# EAGLE design PCBDesign01 (EAGLE 9.5.2)
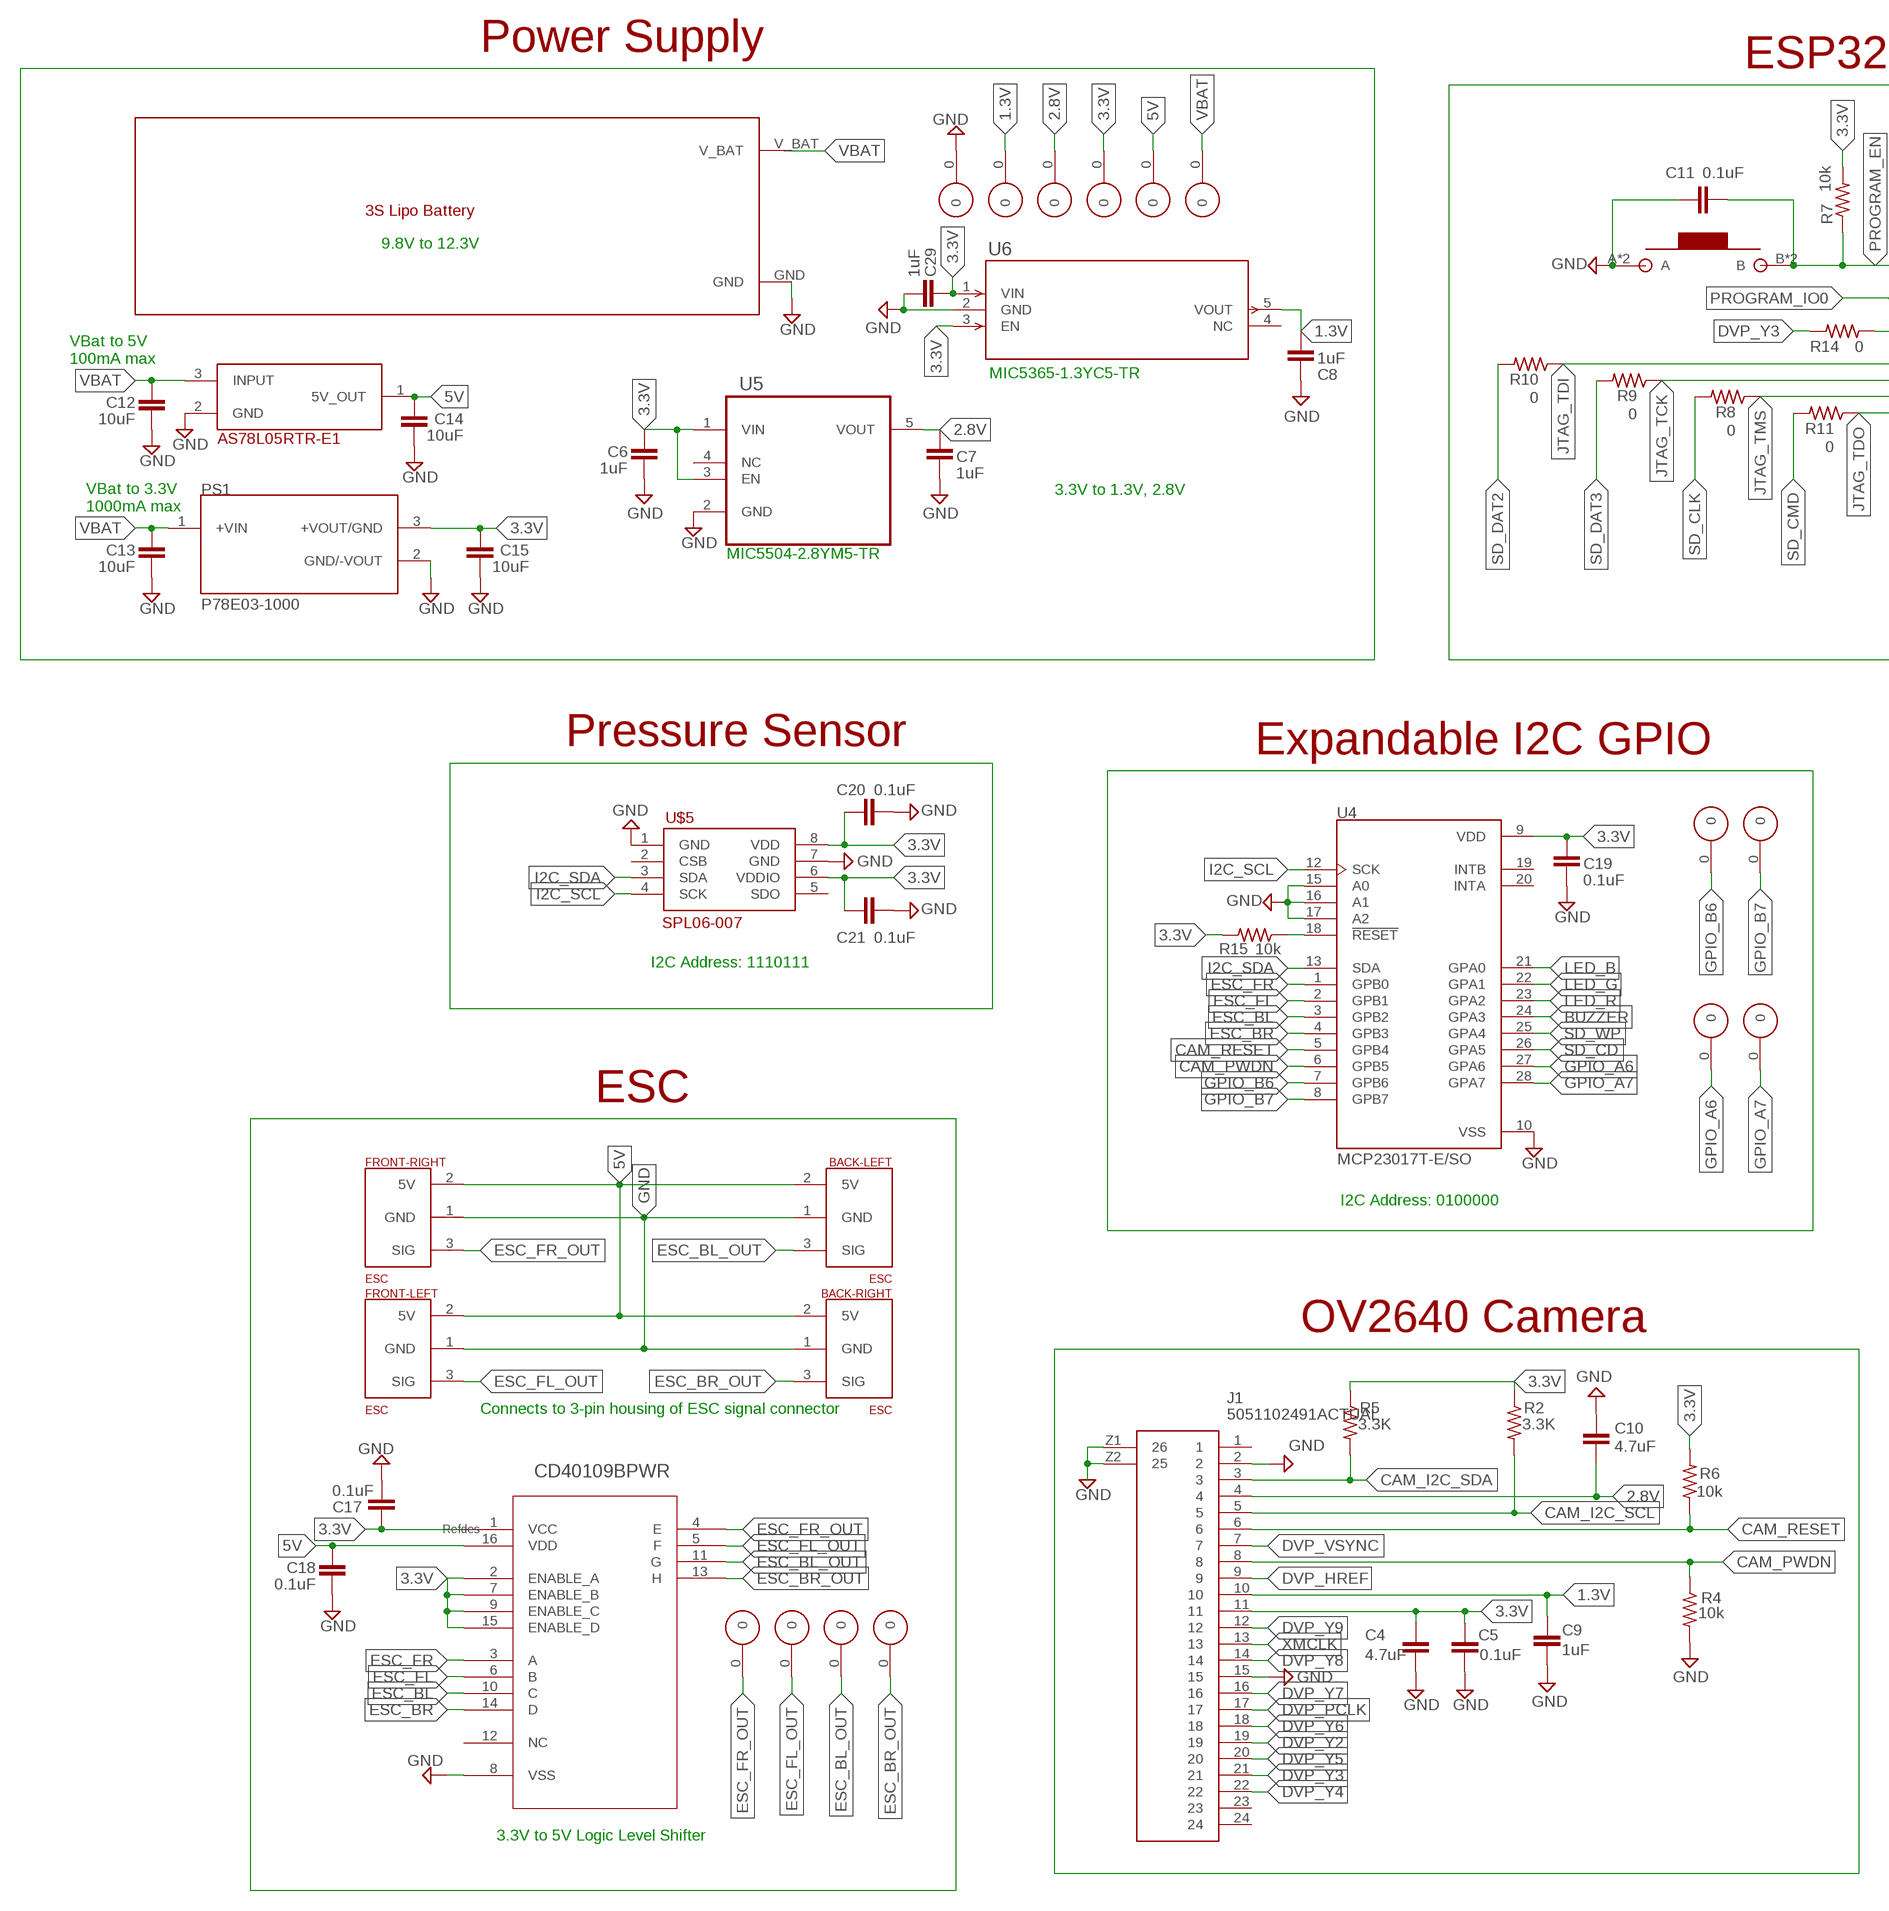
[diagram p0: schematic, sheet 1, part 1 of 2]
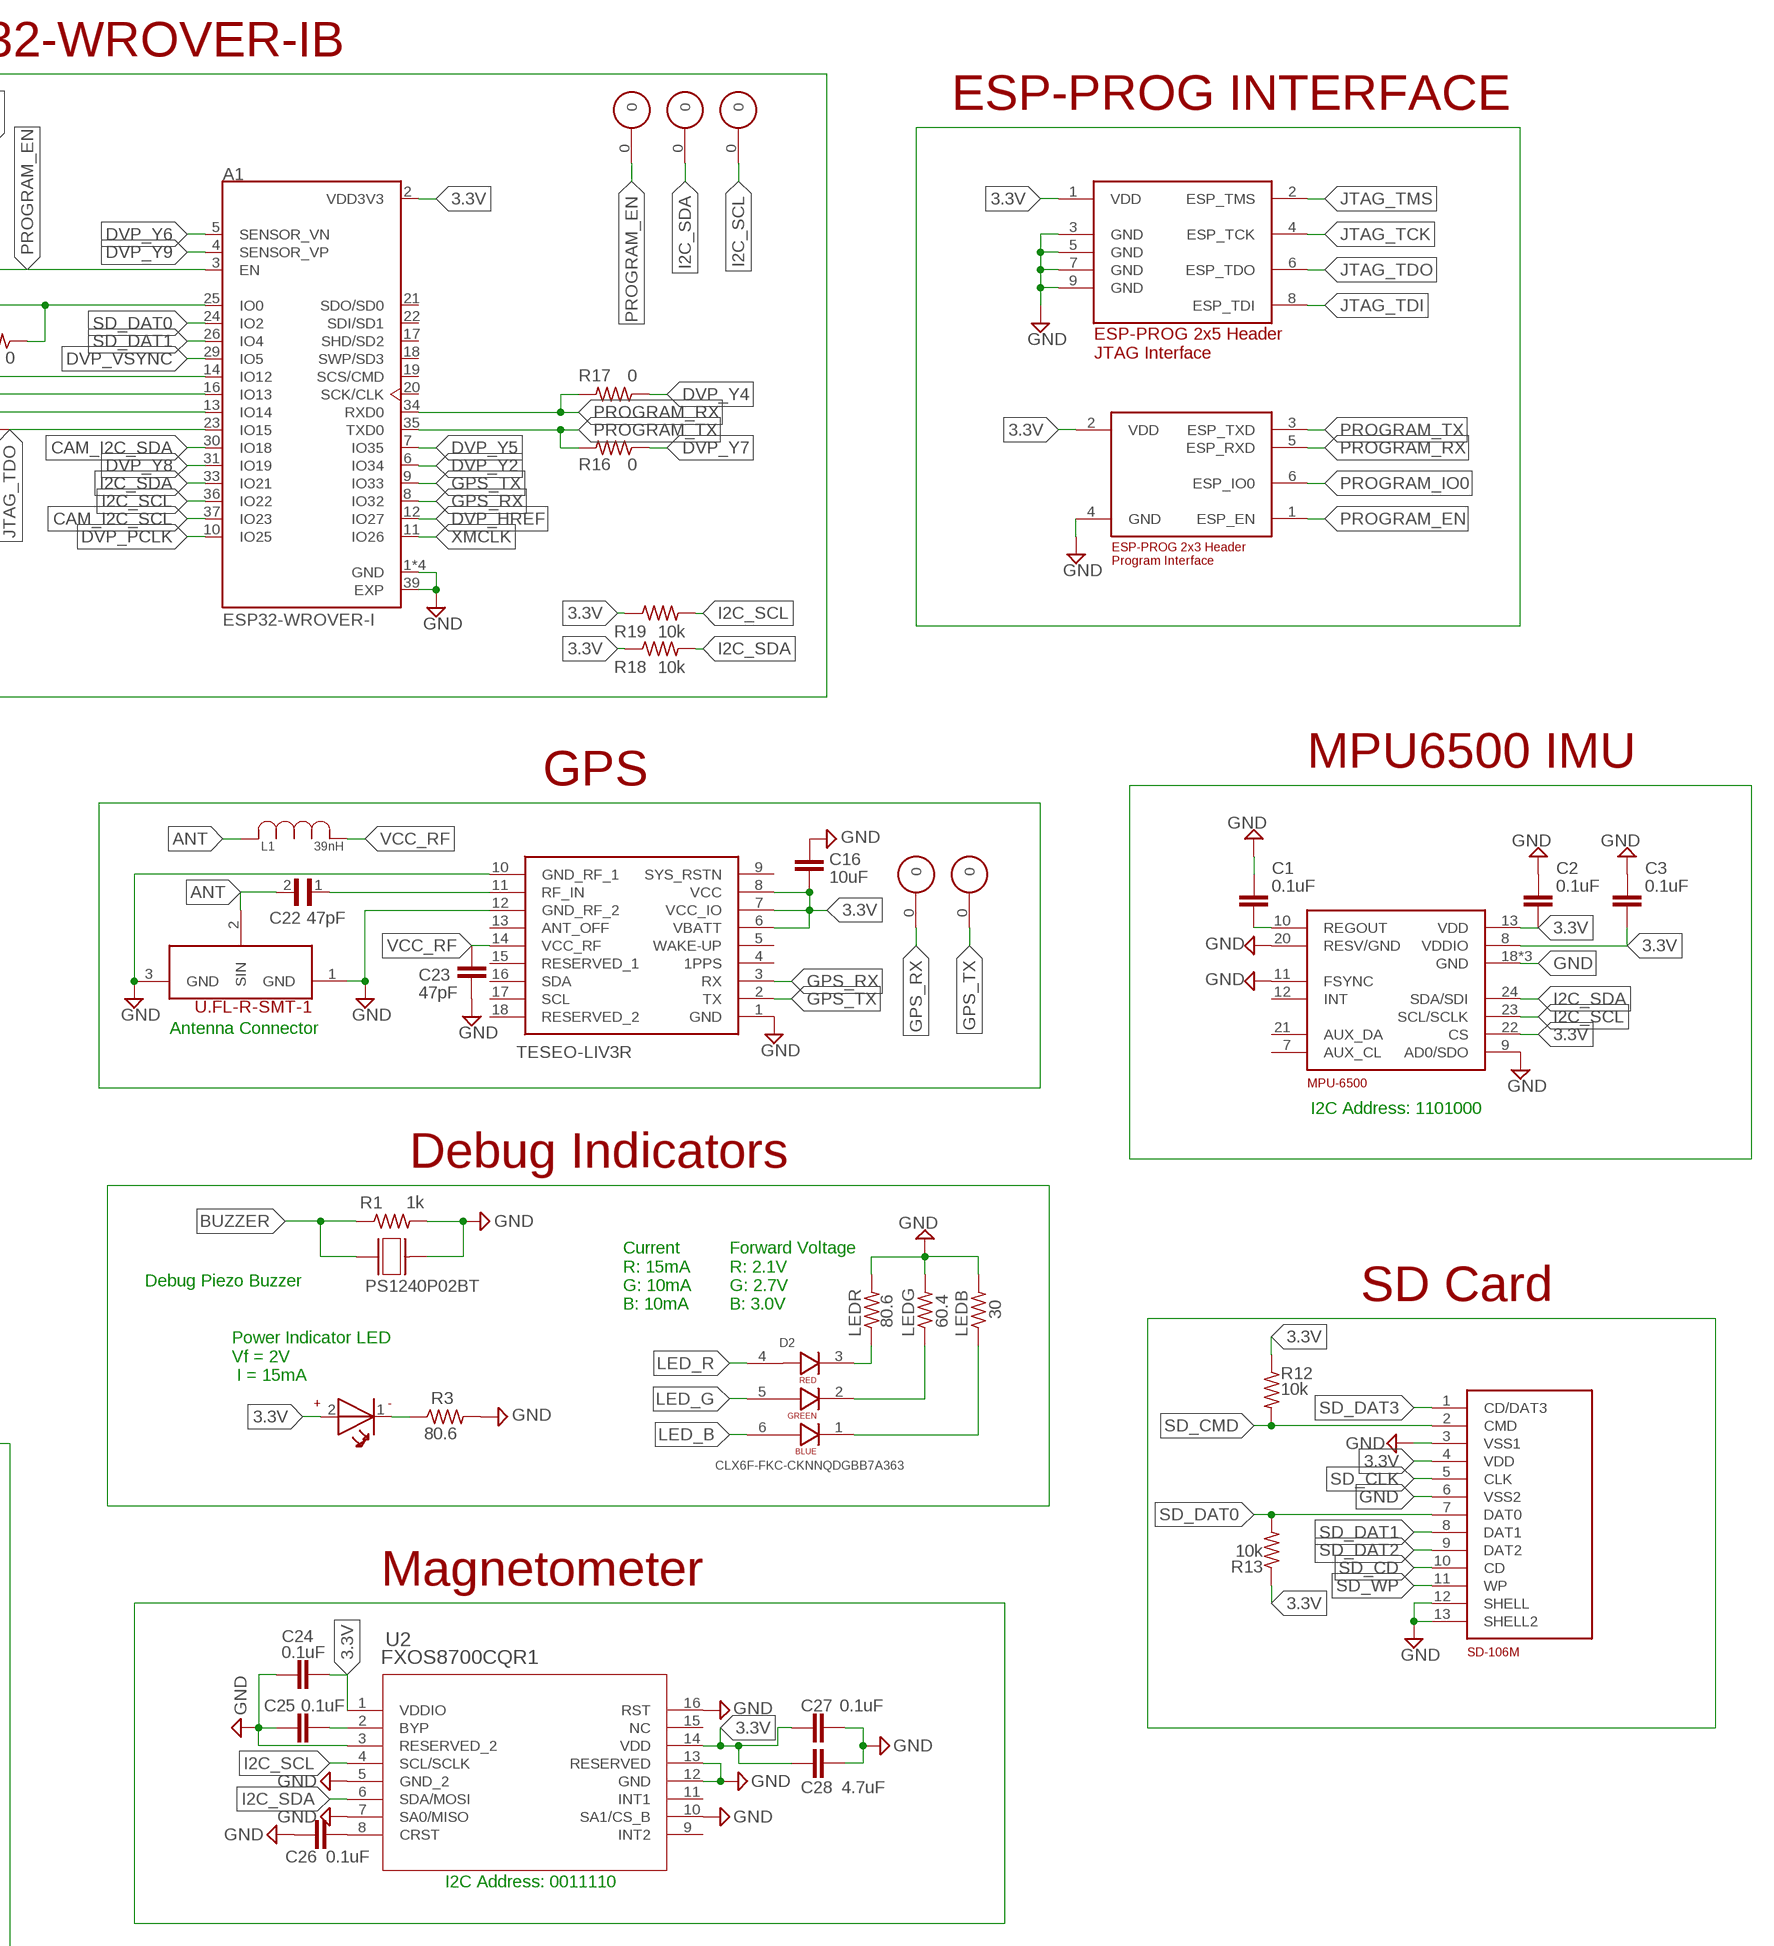
[diagram p1: schematic, sheet 1, part 2 of 2]

## Parts
A1  ESP32-WROVER-I  [XCVR_ESP32-WROVER-I]
BACK-LEFT  ESC  [MA03-1]
BACK-RIGHT  ESC  [MA03-1]
BUZZER  PS1240P02BT  [XDCR_PS1240P02BT]
C1  0.1uF  C_CHIP-0805(2012-METRIC)  [CAPC2012X110]
C2  0.1uF  C_CHIP-0805(2012-METRIC)  [CAPC2012X110]
C3  0.1uF  C_CHIP-0805(2012-METRIC)  [CAPC2012X110]
C4  4.7uF  C_CHIP-0805(2012-METRIC)  [CAPC2012X110]
C5  0.1uF  C_CHIP-0805(2012-METRIC)  [CAPC2012X110]
C6  1uF  C_CHIP-0805(2012-METRIC)  [CAPC2012X110]
C7  1uF  C_CHIP-0805(2012-METRIC)  [CAPC2012X110]
C8  1uF  C_CHIP-0805(2012-METRIC)  [CAPC2012X110]
C9  1uF  C_CHIP-0805(2012-METRIC)  [CAPC2012X110]
C10  4.7uF  C_CHIP-0805(2012-METRIC)  [CAPC2012X110]
C11  0.1uF  C_CHIP-0805(2012-METRIC)  [CAPC2012X110]
C12  10uF  C_CHIP-0805(2012-METRIC)  [CAPC2012X110]
C13  10uF  C_CHIP-0805(2012-METRIC)  [CAPC2012X110]
C14  10uF  C_CHIP-0805(2012-METRIC)  [CAPC2012X110]
C15  10uF  C_CHIP-0805(2012-METRIC)  [CAPC2012X110]
C16  10uF  C_CHIP-0805(2012-METRIC)  [CAPC2012X110]
C17  0.1uF  C_CHIP-0805(2012-METRIC)  [CAPC2012X110]
C18  0.1uF  C_CHIP-0805(2012-METRIC)  [CAPC2012X110]
C19  0.1uF  C_CHIP-0805(2012-METRIC)  [CAPC2012X110]
C20  0.1uF  C_CHIP-0805(2012-METRIC)  [CAPC2012X110]
C21  0.1uF  C_CHIP-0805(2012-METRIC)  [CAPC2012X110]
C22  47pF  C0402C470K5GACTU  [CAPC1005X55N]
C23  47pF  C_CHIP-0805(2012-METRIC)  [CAPC2012X110]
C24  0.1uF  C_CHIP-0805(2012-METRIC)  [CAPC2012X110]
C25  0.1uF  C_CHIP-0805(2012-METRIC)  [CAPC2012X110]
C26  0.1uF  C_CHIP-0805(2012-METRIC)  [CAPC2012X110]
C27  0.1uF  C_CHIP-0805(2012-METRIC)  [CAPC2012X110]
C28  4.7uF  C_CHIP-0805(2012-METRIC)  [CAPC2012X110]
C29  1uF  C_CHIP-0805(2012-METRIC)  [CAPC2012X110]
D2  CLX6F-FKC-CKNNQDGBB7A363  [SOJ100P350X290-6N]
FRONT-LEFT  ESC  [MA03-1]
FRONT-RIGHT  ESC  [MA03-1]
IC1  TESEO-LIV3R  [TESEOLIV3R]
J1  5051102491ACTUAL  [687124149022]
L1  39nH  HK100539NJ-TIND0402_22N_TAI_TAY-M  [IND0402_22N_TAI_TAY-M]
LEDB  30  R-US_CHIP-0805(2012-METRIC)  [RESC2012X65]
LEDG  60.4  R-US_CHIP-0805(2012-METRIC)  [RESC2012X65]
LEDR  80.6  R-US_CHIP-0805(2012-METRIC)  [RESC2012X65]
PS1  P78E03-1000  [CONV_P78E03-1000]
PWR-INDICATOR  WL-SMCW-150060GS75000-G  [WL-SMCW_0603]
R1  1k  R-US_CHIP-0805(2012-METRIC)  [RESC2012X65]
R2  3.3K  R-US_CHIP-0805(2012-METRIC)  [RESC2012X65]
R3  80.6  R-US_CHIP-0805(2012-METRIC)  [RESC2012X65]
R4  10k  R-US_CHIP-0805(2012-METRIC)  [RESC2012X65]
R5  3.3K  R-US_CHIP-0805(2012-METRIC)  [RESC2012X65]
R6  10k  R-US_CHIP-0805(2012-METRIC)  [RESC2012X65]
R7  10k  R-US_CHIP-0805(2012-METRIC)  [RESC2012X65]
R8  0  R-US_CHIP-0805(2012-METRIC)  [RESC2012X65]
R9  0  R-US_CHIP-0805(2012-METRIC)  [RESC2012X65]
R10  0  R-US_CHIP-0805(2012-METRIC)  [RESC2012X65]
R11  0  R-US_CHIP-0805(2012-METRIC)  [RESC2012X65]
R12  10k  R-US_CHIP-0805(2012-METRIC)  [RESC2012X65]
R13  10k  R-US_CHIP-0805(2012-METRIC)  [RESC2012X65]
R14  0  R-US_CHIP-0805(2012-METRIC)  [RESC2012X65]
R15  10k  R-US_CHIP-0805(2012-METRIC)  [RESC2012X65]
R16  0  R-US_CHIP-0805(2012-METRIC)  [RESC2012X65]
R17  0  R-US_CHIP-0805(2012-METRIC)  [RESC2012X65]
R18  10k  R-US_CHIP-0805(2012-METRIC)  [RESC2012X65]
R19  10k  R-US_CHIP-0805(2012-METRIC)  [RESC2012X65]
U2  FXOS8700CQR1  [QFN16_3X3_NXP]
U3  CD40109BPWR  [SOP65P640X120-16N]
U4  MCP23017T-E/SO  [SOIC127P1030X265-28N]
U5  MIC5504-2.8YM5-TR  [SOT95P280X145-5N]
U6  MIC5365-1.3YC5-TRSC-70_C5_MCH-M  [SC-70_C5_MCH-M]
U$1  MPU6500  [QFN40P300X300X105-24N]
U$2  TESTPOINT  [TESTPOINT]
U$3  SD-106M  [SDCARD]
U$4  U.FL-R-SMT-1  [U.FL]
U$5  SPL06-007  [SPL06-007]
U$6  ESP-PROG_JTAG_HEADER  [SAMTEC-FTS-105-01-X-D]
U$7  ESP-PROG_PROGRAM_HEADER  [SAMTEC-FTS-103-01-X-D]
U$8  RESET  BUTTON  [BUTTON]
U$9  TESTPOINT  [TESTPOINT]
U$10  TESTPOINT  [TESTPOINT]
U$11  TESTPOINT  [TESTPOINT]
U$12  TESTPOINT  [TESTPOINT]
U$13  TESTPOINT  [TESTPOINT]
U$14  TESTPOINT  [TESTPOINT]
U$15  TESTPOINT  [TESTPOINT]
U$16  TESTPOINT  [TESTPOINT]
U$17  TESTPOINT  [TESTPOINT]
U$18  TESTPOINT  [TESTPOINT]
U$19  TESTPOINT  [TESTPOINT]
U$20  TESTPOINT  [TESTPOINT]
U$21  TESTPOINT  [TESTPOINT]
U$23  TESTPOINT  [TESTPOINT]
U$24  TESTPOINT  [TESTPOINT]
U$25  TESTPOINT  [TESTPOINT]
U$26  TESTPOINT  [TESTPOINT]
U$27  TESTPOINT  [TESTPOINT]
U$28  AS78L05RTR-E1  [VREG_AP2204RA-3.3TRG1]
U$29  LARGE_BATTERY  [LARGE_BATTERY]

## Nets
1.3V: C8.1 C9.2 J1.10 U6.5(VOUT) U$17.0
2.8V: C7.1 C10.1 J1.4 U5.5(VOUT) U$18.0
3.3V: A1.2(VDD3V3) C2.2 C3.2 C4.1 C5.1 C6.1 C15.2 C16.2 C17.2 C19.2 C20.2 C21.2 C24.2 C27.1 C28.1 C29.1 IC1.6(VBATT) IC1.7(VCC_IO) IC1.8(VCC) J1.11 PS1.3(+VOUT/GND) PWR-INDICATOR.2(+) R2.1 R5.1 R6.2 R7.2 R12.1 R13.1 R15.2 R18.1 R19.1 U2.1(VDDIO) U2.14(VDD) U3.1(VCC) U3.2(ENABLE_A) U3.7(ENABLE_B) U3.9(ENABLE_C) U3.15(ENABLE_D) U4.9(VDD) U5.1(VIN) U5.3(EN) U6.1(VIN) U6.3(EN) U$1.8(VDDIO) U$1.13(VDD) U$1.22(CS) U$3.4(VDD) U$5.6(VDDIO) U$5.8(VDD) U$6.1(VDD) U$7.2(VDD) U$15.0
5V: BACK-LEFT.2(5V) BACK-RIGHT.2(5V) C14.2 C18.2 FRONT-LEFT.2(5V) FRONT-RIGHT.2(5V) U3.16(VDD) U$16.0 U$28.1(5V_OUT)
ANT: C22.2 L1.2 U$4.2(SIN)
BUZZER: BUZZER.1 R1.1 U4.24(GPA3)
CAM_I2C_SCL: A1.37(IO23) J1.5 R2.2
CAM_I2C_SDA: A1.30(IO18) J1.3 R5.2
CAM_PWDN: J1.8 R4.1 U4.6(GPB5)
CAM_RESET: J1.6 R6.1 U4.5(GPB4)
DVP_HREF: A1.12(IO27) J1.9
DVP_PCLK: A1.10(IO25) J1.17
DVP_VSYNC: A1.29(IO5) J1.7
DVP_Y2: A1.6(IO34) J1.19
DVP_Y3: J1.21 R14.2
DVP_Y4: J1.22 R17.1
DVP_Y5: A1.7(IO35) J1.20
DVP_Y6: A1.5(SENSOR_VN) J1.18
DVP_Y7: J1.16 R16.1
DVP_Y8: A1.31(IO19) J1.14
DVP_Y9: A1.4(SENSOR_VP) J1.12
ESC_BL: U3.10(C) U4.3(GPB2)
ESC_BL_OUT: BACK-LEFT.3(SIG) U3.11(G) U$25.0
ESC_BR: U3.14(D) U4.4(GPB3)
ESC_BR_OUT: BACK-RIGHT.3(SIG) U3.13(H) U$27.0
ESC_FL: U3.6(B) U4.2(GPB1)
ESC_FL_OUT: FRONT-LEFT.3(SIG) U3.5(F) U$26.0
ESC_FR: U3.3(A) U4.1(GPB0)
ESC_FR_OUT: FRONT-RIGHT.3(SIG) U3.4(E) U$24.0
GND: A1.1(GND) A1.15(GND) A1.38(GND) A1.39(EXP) A1.P$1(GND) BACK-LEFT.1(GND) BACK-RIGHT.1(GND) BUZZER.2 C1.1 C2.1 C3.1 C4.2 C5.2 C6.2 C7.2 C8.2 C9.1 C10.2 C11.1 C12.1 C13.1 C14.1 C15.1 C16.1 C17.1 C18.1 C19.1 C20.1 C21.1 C23.1 C24.1 C25.2 C26.2 C27.2 C28.2 C29.2 FRONT-LEFT.1(GND) FRONT-RIGHT.1(GND) IC1.1(GND) IC1.10(GND_RF_1) IC1.12(GND_RF_2) J1.2 J1.15 J1.Z1 J1.Z2 LEDB.2 LEDG.2 LEDR.2 PS1.2(GND/-VOUT) R1.2 R3.2 R4.2 U2.3(RESERVED_2) U2.5(GND_2) U2.7(SA0/MISO) U2.10(SA1/CS_B) U2.12(GND) U2.13(RESERVED) U2.16(RST) U3.8(VSS) U4.10(VSS) U4.15(A0) U4.16(A1) U4.17(A2) U5.2(GND) U6.2(GND) U$1.9(AD0/SDO) U$1.11(FSYNC) U$1.18(GND) U$1.20(RESV/GND) U$1.25(GND) U$1.P$1(GND) U$3.3(VSS1) U$3.6(VSS2) U$3.12(SHELL) U$3.13(SHELL2) U$4.1(GND) U$4.3(GND) U$5.1(GND) U$5.7(GND) U$6.3(GND) U$6.5(GND) U$6.7(GND) U$6.9(GND) U$7.4(GND) U$8.A U$8.A@1(A) U$21.0 U$28.2(GND) U$29.GND
GPIO_A6: U4.27(GPA6) U$2.0
GPIO_A7: U4.28(GPA7) U$19.0
GPIO_B6: U4.7(GPB6) U$14.0
GPIO_B7: U4.8(GPB7) U$20.0
GPS_RX: A1.8(IO32) IC1.3(RX) U$11.0
GPS_TX: A1.9(IO33) IC1.2(TX) U$12.0
I2C_SCL: A1.36(IO22) R19.2 U2.4(SCL/SCLK) U4.12(SCK) U$1.23(SCL/SCLK) U$5.4(SCK) U$10.0
I2C_SDA: A1.33(IO21) R18.2 U2.6(SDA/MOSI) U4.13(SDA) U$1.24(SDA/SDI) U$5.3(SDA) U$9.0
JTAG_TCK: A1.16(IO13) R9.1 U$6.4(ESP_TCK)
JTAG_TDI: A1.14(IO12) R10.1 U$6.8(ESP_TDI)
JTAG_TDO: A1.23(IO15) R11.1 U$6.6(ESP_TDO)
JTAG_TMS: A1.13(IO14) R8.1 U$6.2(ESP_TMS)
LED_B: D2.6 U4.21(GPA0)
LED_G: D2.5 U4.22(GPA1)
LED_R: D2.4 U4.23(GPA2)
N$1: D2.3 LEDR.1
N$2: D2.2 LEDG.1
N$3: C1.2 U$1.10(REGOUT)
N$4: D2.1 LEDB.1
N$5: C26.1 U2.8(CRST)
N$6: PWR-INDICATOR.1(-) R3.1
N$18: C25.1 U2.2(BYP)
N$21: C22.1 IC1.11(RF_IN)
N$23: R15.1 U4.18(!RESET)
PROGRAM_EN: A1.3(EN) C11.2 R7.1 U$7.1(ESP_EN) U$8.B U$8.B@1(B) U$23.0
PROGRAM_IO0: A1.25(IO0) R14.1 U$7.6(ESP_IO0)
PROGRAM_RX: A1.34(RXD0) R17.2 U$7.5(ESP_RXD)
PROGRAM_TX: A1.35(TXD0) R16.2 U$7.3(ESP_TXD)
SD_CD: U4.26(GPA5) U$3.10(CD)
SD_CLK: R8.2 U$3.5(CLK)
SD_CMD: R11.2 R12.2 U$3.2(CMD)
SD_DAT0: A1.24(IO2) R13.2 U$3.7(DAT0)
SD_DAT1: A1.26(IO4) U$3.8(DAT1)
SD_DAT2: R10.2 U$3.9(DAT2)
SD_DAT3: R9.2 U$3.1(CD/DAT3)
SD_WP: U4.25(GPA4) U$3.11(WP)
VBAT: C12.2 C13.2 PS1.1(+VIN) U$13.0 U$28.3(INPUT) U$29.V_BAT
VCC_RF: C23.2 IC1.14(VCC_RF) L1.1
XMCLK: A1.11(IO26) J1.13
Unconnected: A1.17(SHD/SD2) A1.18(SWP/SD3) A1.19(SCS/CMD) A1.20(SCK/CLK) A1.21(SDO/SD0) A1.22(SDI/SD1) IC1.4(1PPS) IC1.5(WAKE-UP) IC1.9(SYS_RSTN) IC1.13(ANT_OFF) IC1.15(RESERVED_1) IC1.16(SDA) IC1.17(SCL) IC1.18(RESERVED_2) J1.1 J1.23 J1.24 U2.9(INT2) U2.11(INT1) U2.15(NC) U3.12(NC) U4.19(INTB) U4.20(INTA) U5.4(NC) U6.4(NC) U$1.7(AUX_CL) U$1.12(INT) U$1.21(AUX_DA) U$5.2(CSB) U$5.5(SDO)

## Notes on the sheet
- Power Supply
- ESP32-WROVER-IB
- ESP-PROG INTERFACE
- 9.8V to 12.3V
- VBat to 5V
  100mA max
- MIC5365-1.3YC5-TR
- 3.3V to 1.3V, 2.8V
- VBat to 3.3V
  1000mA max
- MIC5504-2.8YM5-TR
- MPU6500 IMU
- Pressure Sensor | GPS
- Expandable I2C GPIO
- I2C Address: 1110111 | Antenna Connector
- I2C Address: 1101000
- ESC | Debug Indicators
- I2C Address: 0100000 | Debug Piezo Buzzer
- SD Card
- Current
  R: 15mA
  G: 10mA
  B: 10mA
- Forward Voltage
  R: 2.1V
  G: 2.7V
  B: 3.0V
- Power Indicator LED
  Vf = 2V
   I = 15mA
- OV2640 Camera
- Connects to 3-pin housing of ESC signal connector
- Magnetometer
- I2C Address: 0011110
- 3.3V to 5V Logic Level Shifter

## Library data of the parts
A1 = ESP32-WROVER-I:ESP32-WROVER-I: Module: combo; GPIO, I2C x2, I2S x2, SDIO, SPI x3, UART x3; U.FL; AVAILABILITY: Unavailable; DESCRIPTION: Bluetooth, WiFi 802.11b/g/n, Bluetooth v4.2 +EDR, Class 1, 2 and 3 Transceiver Module 2.4GHz ~ 2.5GHz Antenna Not Included, I-PEX Surface Mount; MF: Espressif Systems; MP: ESP32-WROVER-I; PACKAGE: Module Espressif Systems; PRICE: None
BACK-LEFT BACK-RIGHT FRONT-LEFT FRONT-RIGHT = ESC:ESC
BUZZER = PS1240P02BT:PS1240P02BT: Buzzers Transducer, Externally Driven Piezo 3V 4kHz 60dB @ 3V, 10cm Through Hole PC Pins; DESCRIPTION: Buzzers Transducer, Externally Driven Piezo 3V 4kHz 60dB @ 3V, 10cm Through Hole PC Pins; DIGI-KEY_PART_NUMBER: 445-2525-1-ND; DIGI-KEY_PURCHASE_URL: https://www.digikey.com/product-detail/en/tdk-corporation/PS1240P02BT/445-2525-1-ND/935930?utm_source=snapeda&utm_medium=aggregator&utm_campaign=symbol; MF: TDK; MP: PS1240P02BT; PACKAGE: 2020 TDK
C1-C21 C23-C29 = Capacitor:C: Capacitor - Generic; CATEGORY: Capacitor
C22 = C0402C470K5GACTU:C0402C470K5GACTU: CAP MLCC, 47PF, 50V, C0G, 10%, 0402; Product Range:KEMET - C Series; Capacitance; DESCRIPTION: 47pF ±10% 50V Ceramic Capacitor C0G, NP0 0402 _1005 Metric_; DIGI-KEY_PART_NUMBER: 399-7796-1-ND; DIGI-KEY_PURCHASE_URL: https://www.digikey.com/product-detail/en/kemet/C0402C470K5GACTU/399-7796-1-ND/3471519?utm_source=snapeda&utm_medium=aggregator&utm_campaign=symbol; MF: KEMET; MP: C0402C470K5GACTU; PACKAGE: 0402 KEMET
D2 = CLX6F-FKC-CKNNQDGBB7A363:CLX6F-FKC-CKNNQDGBB7A363: LED Tri-Color Blue/Green/Red 470nm/527nm/630nm Automotive 6-Pin PLCC T/R; AVAILABILITY: Unavailable; DESCRIPTION: Red, Green, Blue _RGB_ 622nm Red, 530nm Green, 470nm Blue LED Indication - Discrete 2.1V Red, 2.7V Green, 3V Blue 6-SMD, J-Lead; MF: Cree Inc.; MP: CLX6F-FKC-CKNNQDGBB7A363; PACKAGE: PLCC-6 Cree; PRICE: None
IC1 = TESEO-LIV3R:TESEO-LIV3R: RF Receiver Teseo ROM GNSS module Source: Datasheet <https://www.mouser.com/datasheet/2/389/teseo-liv3r-1594843.pdf>; DESCRIPTION: RF Receiver Teseo ROM GNSS module; HEIGHT: 2.3mm; MANUFACTURER_NAME: STMicroelectronics; MANUFACTURER_PART_NUMBER: TESEO-LIV3R; MOUSER_PART_NUMBER: 511-TESEO-LIV3R; MOUSER_PRICE-STOCK: https://www.mouser.co.uk/ProductDetail/STMicroelectronics/TESEO-LIV3R?qs=ZSypp649SOXG7EmhCFcBlw%3D%3D
J1 = 5051102491:5051102491: CONN FFC/FPC BOTTOM 24P .5MM R/A Source: Datasheet <https://www.molex.com/webdocs/datasheets/pdf/en-us/5051102491_FFC_FPC_CONNECTORS.pdf>
L1 = 0402 Inductor:HK100539NJ-T; BUILT_BY: EMA_UL_Team; MANUFACTURER_PART_NUMBER: HK100539NJ-T; SOURCELIBRARY: TaiyoYuden_2011-01-01_Digkey1; VENDOR: Taiyo Yuden
LEDB LEDG LEDR R1-R19 = Resistor:R-US: Resistor Fixed - ANSI; CATEGORY: Resistor; SUB-CATEGORY: Fixed
PS1 = P78E03-1000:P78E03-1000: NON-ISOLATED DC SWITCHING REGULATOR; MANUFACTURER: CUI Inc; STANDARD: Manufacturer Recommendations
PWR-INDICATOR = WL-SMCW:WL-SMCW: SMD mono-color Chip LED Characteristics Low energy consumption High reliability Low current requirement Fast switching No UV/IR radiation Smallest SMD package with exceptional brightness Top view Wide viewing angle PBC high-usage Applications Backlight for mobile and portable device keypads Indoor and outdoor message boards Flat backlight for LCDs, switches and symbols Display for industrial control systems and traffic Miniaturized color effects Pedestrian mark Optical indicators General lighting Toys <http://katalog.we-online.de/media/images/eipal/WL-SMCW_pf2.jpg> Details see: http://katalog.we-online.de/en/led/WL-SMCW?m Updated 2015-04-10 2015 (C) Wurth Elektronik; AVAILABILITY: Unavailable; DESCRIPTION: Green 570nm LED Indication - Discrete 2V 0603 _1608 Metric_; MF: Wurth Electronics; MP: 150060VS75000; PACKAGE: 0603 Wurth Electronics; PRICE: None
U2 = FXOS8700CQR1 Magnetometer:FXOS8700CQR1; BUILT_BY: EMA_Jessica; COPYRIGHT: Copyright (C) 2018 Accelerated Designs. All rights reserved; MANUFACTURER_PART_NUMBER: FXOS8700CQR1; SOURCELIBRARY: NXP_2019-12-31; VENDOR: NXP
U3 = CD40109BPWR:CD40109BPWR: CMOS Quad low to high Voltage level shifter; DESCRIPTION: Voltage Level Translator Unidirectional 4 Circuit 1 Channel 16-TSSOP; DIGI-KEY_PART_NUMBER: 296-12163-1-ND; DIGI-KEY_PURCHASE_URL: https://www.digikey.com/product-detail/en/texas-instruments/CD40109BPWR/296-12163-1-ND/412005?utm_source=snapeda&utm_medium=aggregator&utm_campaign=symbol; MF: Texas Instruments; MP: CD40109BPWR; PACKAGE: TSSOP-16 Texas Instruments
U4 = MCP23017T-E_SO:MCP23017T-E/SO: 16-bit Input/Output Expander, I2C interface, Pb-free28 SOIC .300in T/R; DESCRIPTION: I/O Expander 16 I²C 1.7MHz 28-SOIC; DIGI-KEY_PART_NUMBER: MCP23017T-E/SOCT-ND; DIGI-KEY_PURCHASE_URL: https://www.digikey.com/product-detail/en/microchip-technology/MCP23017T-E-SO/MCP23017T-E-SOCT-ND/5358289?utm_source=snapeda&utm_medium=aggregator&utm_campaign=symbol; MF: Microchip; MP: MCP23017T-E/SO; PACKAGE: SOIC-28 Microchip
U5 = MIC5504_2.8YM5:MIC5504-2.8YM5-TR: LOW INPUT VOLTAGE SYNCHRONOUS BOOST CONVERTER; AVAILABILITY: Unavailable; DESCRIPTION: 0.9Vin, 3.3Vout Boost Converter with Bypass Switch - 5nA Shutdown Current, SOT-23 5-SOT-23 -40 to 85; DIGIKEY-PURCHASE-URL: https://snapeda.com/shop?store=DigiKey&id=275825; MF: Texas Instruments; MP: TPS61097-33DBVR; PACKAGE: SOT-23-5 Texas Instruments; PRICE: None
U6 = MIC5365_1.3YC5:MIC5365-1.3YC5-TR; BUILT_BY: EMA_Jessica; COPYRIGHT: Copyright (C) 2018 Accelerated Designs. All rights reserved; MANUFACTURER_PART_NUMBER: MIC5365-1.3YC5-TR; SOURCELIBRARY: Microchip_2019-08-23_3; VENDOR: Microchip
U$1 = MPU-6500:MPU6500
U$2 U$9-U$21 U$23-U$27 = Test Point:TESTPOINT
U$3 = SD-106M:SD-106M
U$4 = UFL:U.FL-R-SMT-1
U$5 = SPL06-007:SPL06-007
U$6 = ESP-PROG:ESP-PROG_JTAG_HEADER
U$7 = ESP-PROG:ESP-PROG_PROGRAM_HEADER
U$8 = Button:BUTTON
U$28 = AS78L05RTR-E1:AS78L05RTR-E1
U$29 = CustomBattery:LARGE_BATTERY

## Board
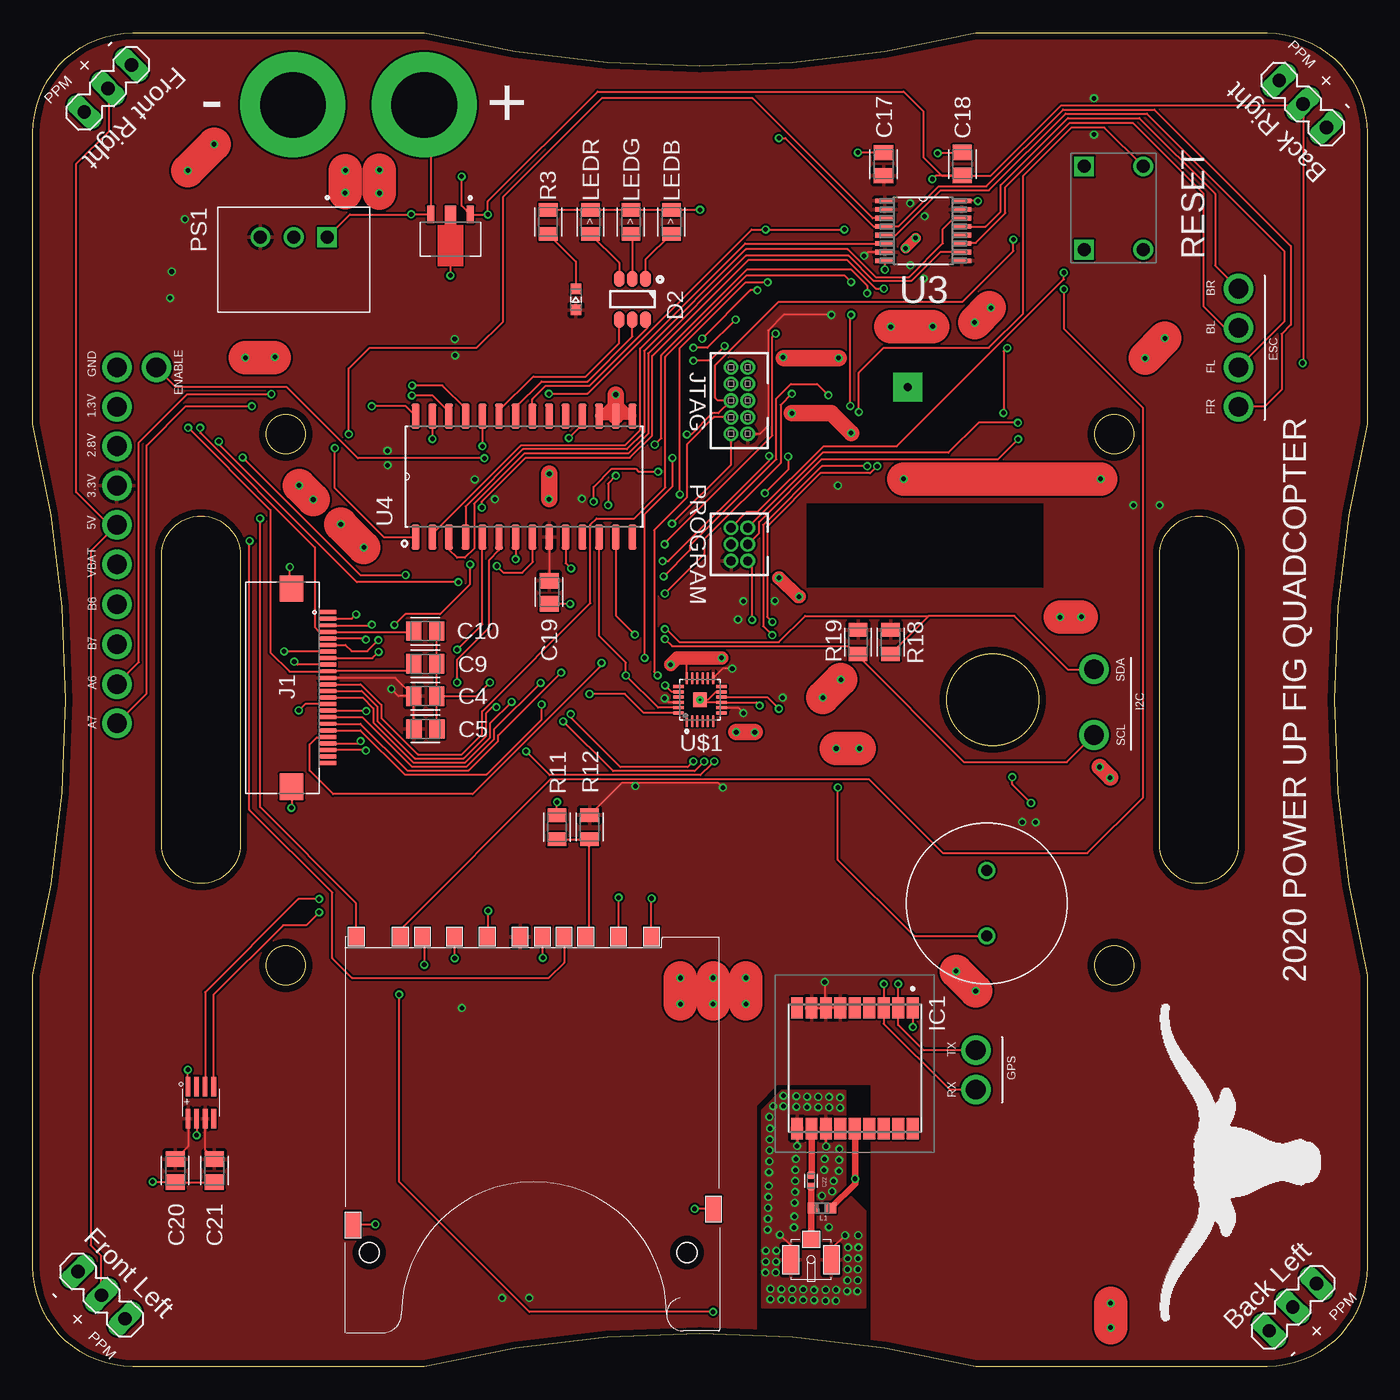
[diagram p2: board, top side]
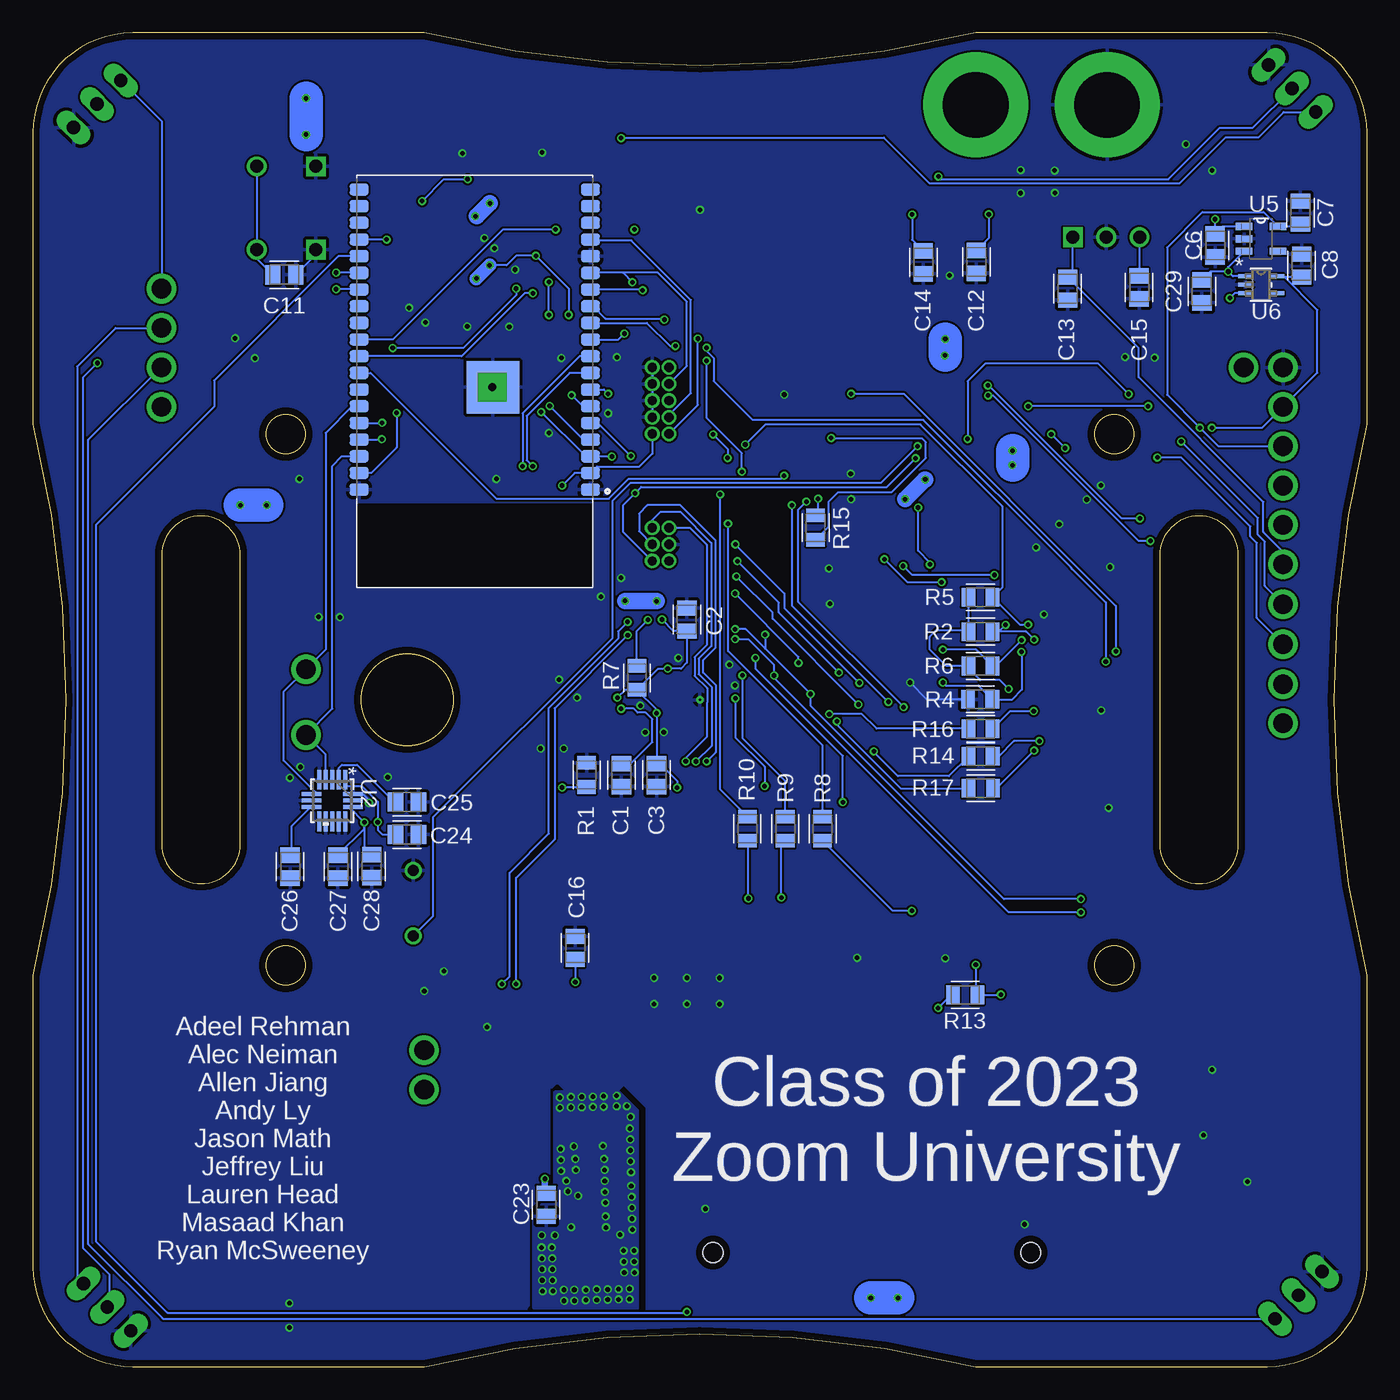
[diagram p3: board, bottom side, seen from below]

Size 101.6 x 101.6 mm. Coordinates in mm from the lower left corner, seen from the top.
Outline: 101.6,7.62 arc-90 93.98,0 71.81,0 arc27 29.79,0 7.62,0 arc-90 0,7.62 0,29.79 arc27 0,71.81 0,93.98 arc-90 7.62,101.6 29.79,101.6 arc27 71.81,101.6 93.98,101.6 arc-90 101.6,93.98 101.6,71.81 arc27 101.6,29.79 101.6,7.62
Outline: 85.8,61.8 arc-180 91.8,61.8 91.8,39.8 arc-180 85.8,39.8 85.8,61.8
Outline: 9.8,61.8 arc-180 15.8,61.8 15.8,39.8 arc-180 9.8,39.8 9.8,61.8
Outline: circle at 73.1,50.8 radius 3.51
Outline: circle at 19.26,30.57 radius 1.5
Outline: circle at 82.34,30.57 radius 1.5
Outline: circle at 82.34,71.03 radius 1.5
Outline: circle at 19.26,71.03 radius 1.5
Copper layers (1*16): Top 0.035mm / dielectric 1.5mm / Bottom 0.035mm
Design rules "default *": minimum track width 5mil, minimum drill 0.2mm, track to track 6mil, track to pad 6mil, pad to pad 6mil, via to via 6mil, smd to smd 6mil, copper to edge 20mil, drill to drill 4mil, minimum pad ring 0.2mm, minimum via ring 0.13mm, stop-mask expansion 4mil, vias tented up to drill 0mil, thermal gap 10mil

### Footprints (pad centres in the part's own frame; a part is rotated, then mirrored left to right if it is on the bottom)
XCVR_ESP32-WROVER-I = smd 1.45 x 0.93: 1 -8.81,8.26; 2 -8.81,6.99; 3 -8.81,5.72; 4 -8.81,4.45; 5 -8.81,3.18; 6 -8.81,1.91; 7 -8.81,0.64; 8 -8.81,-0.63; 9 -8.81,-1.9; 10 -8.81,-3.17; 11 -8.81,-4.44; 12 -8.81,-5.71; 13 -8.81,-6.98; 14 -8.81,-8.25; 15 -8.81,-9.52; 16 -8.81,-10.79; 17 -8.81,-12.06; 18 -8.81,-13.33; 19 -8.81,-14.6; 20 8.81,-14.6; 21 8.81,-13.33; 22 8.81,-12.06; 23 8.81,-10.79; 24 8.81,-9.52; 25 8.81,-8.25; 26 8.81,-6.98; 27 8.81,-5.71; 28 8.81,-4.44; 29 8.81,-3.17; 30 8.81,-1.9; 31 8.81,-0.63; 32 8.81,0.64; 33 8.81,1.91; 34 8.81,3.18; 35 8.81,4.45; 36 8.81,5.72; 37 8.81,6.99; 38 8.81,8.26 | smd 4 x 4: 39 -1.38,0.47 | drill 0.6 pad 2.184 square: P$1 -1.329,0.454
MA03-1 = drill 1.016 long: 1 -2.54,0; 2 0,0; 3 2.54,0
XDCR_PS1240P02BT = drill 0.85 pad 1.28: 1 -2.5,0; 2 2.5,0
CAPC2012X110 = smd 1.165 x 1.465: 1 -0.875,0; 2 0.875,0
CAPC1005X55N = smd 0.54 x 0.6: 1 -0.43,0; 2 0.43,0
SOJ100P350X290-6N = smd 1.25 x 0.8: 1 -1.55,1; 2 -1.55,0; 3 -1.55,-1; 4 1.55,-1; 5 1.55,0; 6 1.55,1
TESEOLIV3R = smd 0.9 x 1.6: 1 4.4,4.6; 2 3.3,4.6; 3 2.2,4.6; 4 1.1,4.6; 5 0,4.6; 6 -1.1,4.6; 7 -2.2,4.6; 8 -3.3,4.6; 9 -4.4,4.6; 10 -4.4,-4.6; 11 -3.3,-4.6; 12 -2.2,-4.6; 13 -1.1,-4.6; 14 0,-4.6; 15 1.1,-4.6; 16 2.2,-4.6; 17 3.3,-4.6; 18 4.4,-4.6
687124149022 = smd 0.3 x 1.3: 1 -5.75,0; 2 -5.25,0; 3 -4.75,0; 4 -4.25,0; 5 -3.75,0; 6 -3.25,0; 7 -2.75,0; 8 -2.25,0; 9 -1.75,0; 10 -1.25,0; 11 -0.75,0; 12 -0.25,0; 13 0.25,0; 14 0.75,0; 15 1.25,0; 16 1.75,0; 17 2.25,0; 18 2.75,0; 19 3.25,0; 20 3.75,0; 21 4.25,0; 22 4.75,0; 23 5.25,0; 24 5.75,0 | smd 2 x 1.8: Z1 -7.55,-2.75; Z2 7.55,-2.75
IND0402_22N_TAI_TAY-M = smd 0.813 x 0.813: 1 -0.673,0; 2 0.673,0
RESC2012X65 = smd 1.031 x 1.42: 1 -0.919,0; 2 0.919,0
CONV_P78E03-1000 = drill 1 square: 1 -2.54,0 | drill 1: 2 0,0; 3 2.54,0
WL-SMCW_0603 = smd 0.8 x 0.8: 1 -0.8,0; 2 0.8,0
QFN16_3X3_NXP = smd 1.5 x 0.305: 1 -1.587,1; 2 -1.587,0.5; 3 -1.587,0; 4 -1.587,-0.5; 5 -1.587,-1; 9 1.588,-1; 10 1.588,-0.5; 11 1.588,0; 12 1.588,0.5; 13 1.588,1 | smd 0.305 x 1.5: 6 -0.5,-1.591; 7 0,-1.591; 8 0.5,-1.591; 14 0.5,1.59; 15 0,1.59; 16 -0.5,1.59
SOP65P640X120-16N = smd 1.473 x 0.356: 1 -2.921,2.286; 2 -2.921,1.626; 3 -2.921,0.965; 4 -2.921,0.33; 5 -2.921,-0.33; 6 -2.921,-0.965; 7 -2.921,-1.626; 8 -2.921,-2.286; 9 2.921,-2.286; 10 2.921,-1.626; 11 2.921,-0.965; 12 2.921,-0.33; 13 2.921,0.33; 14 2.921,0.965; 15 2.921,1.626; 16 2.921,2.286
SOIC127P1030X265-28N = smd 1.91 x 0.6: 1 -4.61,8.255; 2 -4.61,6.985; 3 -4.61,5.715; 4 -4.61,4.445; 5 -4.61,3.175; 6 -4.61,1.905; 7 -4.61,0.635; 8 -4.61,-0.635; 9 -4.61,-1.905; 10 -4.61,-3.175; 11 -4.61,-4.445; 12 -4.61,-5.715; 13 -4.61,-6.985; 14 -4.61,-8.255; 15 4.61,-8.255; 16 4.61,-6.985; 17 4.61,-5.715; 18 4.61,-4.445; 19 4.61,-3.175; 20 4.61,-1.905; 21 4.61,-0.635; 22 4.61,0.635; 23 4.61,1.905; 24 4.61,3.175; 25 4.61,4.445; 26 4.61,5.715; 27 4.61,6.985; 28 4.61,8.255
SOT95P280X145-5N = smd 1.27 x 0.559: 1 -1.295,0.94; 2 -1.295,0; 3 -1.295,-0.94; 4 1.295,-0.94; 5 1.295,0.94
SC-70_C5_MCH-M = smd 1.079 x 0.305: 1 -1.213,0.65; 2 -1.213,0; 3 -1.213,-0.65; 4 1.213,-0.65; 5 1.213,0.65
QFN40P300X300X105-24N = smd 0.84 x 0.22: 1 -1.645,1; 2 -1.645,0.6; 3 -1.645,0.2; 4 -1.645,-0.2; 5 -1.645,-0.6; 6 -1.645,-1; 13 1.645,-1; 14 1.645,-0.6; 15 1.645,-0.2; 16 1.645,0.2; 17 1.645,0.6; 18 1.645,1 | smd 0.22 x 0.84: 7 -1,-1.645; 8 -0.6,-1.645; 9 -0.2,-1.645; 10 0.2,-1.645; 11 0.6,-1.645; 12 1,-1.645; 19 1,1.645; 20 0.6,1.645; 21 0.2,1.645; 22 -0.2,1.645; 23 -0.6,1.645; 24 -1,1.645 | smd 1.104 x 1: 25 0,0 | drill 0.2: P$1 0,0
TESTPOINT = drill 1.5: 0 0,0
SDCARD = smd 1.2 x 1.5: 1 6.251,9.959; 2 3.747,9.959; 3 0.453,9.964; 4 -1.252,9.964; 5 -3.752,9.959; 6 -6.251,9.964; 7 -8.691,9.967; 8 -10.384,9.967; 9 8.751,9.964; 10 2.1,9.964; 11 -13.726,9.957 | smd 1.2 x 2: 12 -13.981,-11.99; 13 13.476,-10.779 | hole 1.524: 11.465,-14.09; -12.735,-14.089
U.FL = smd 1.2 x 2.2: 1 -1.55,-0.488; 3 1.551,-0.496 | smd 1.3 x 1.3: 2 -0.001,-2.045
SPL06-007 = smd 0.35 x 1.5: 1 -0.975,1.219; 2 -0.326,1.219; 3 0.322,1.219; 4 0.974,1.219; 5 0.975,-1.227; 6 0.326,-1.227; 7 -0.325,-1.227; 8 -0.975,-1.227
SAMTEC-FTS-105-01-X-D = drill 0.71 pad 1.1: 1 -2.54,-0.635; 2 -2.54,0.635; 3 -1.27,-0.635; 4 -1.27,0.635; 5 0,-0.635; 6 0,0.635; 7 1.27,-0.635; 8 1.27,0.635; 9 2.54,-0.635; 10 2.54,0.635
SAMTEC-FTS-103-01-X-D = drill 0.71 pad 1.05: 1 -1.27,-0.635; 2 -1.27,0.635; 3 0,-0.635; 4 0,0.635; 5 1.27,-0.635; 6 1.27,0.635
BUTTON = drill 1 square: A -3.81,2.54; A@1 2.54,2.54 | drill 1: B -3.81,-1.96; B@1 2.54,-1.96
VREG_AP2204RA-3.3TRG1 = smd 1.3 x 0.55: 1 -1.65,1.5; 3 -1.65,-1.5 | smd 1.3 x 0.8: 2 -1.65,0
LARGE_BATTERY = drill 5 pad 8: GND 0,10; V_BAT 0,0

### Placement (x,y rotation side)
A1  67.95,75.07 180 bottom
BACK-LEFT  95.94,4.53 45 top
BACK-RIGHT  96.71,96.18 135 top
BUZZER  72.64,35.3 90 top
C1  56.78,45.06 90 bottom
C2  51.8,56.92 270 bottom
C3  54.11,45.06 90 bottom
C4  29.88,51.07 0 top
C5  29.89,48.58 0 top
C6  11.58,85.41 270 bottom
C7  5.08,87.91 90 bottom
C8  4.99,83.87 90 bottom
C9  29.88,53.54 180 top
C10  29.88,56.03 0 top
C11  82.46,83.16 180 bottom
C12  29.76,84.15 90 bottom
C13  22.8,82.12 90 bottom
C14  33.8,84.12 90 bottom
C15  17.37,82.21 90 bottom
C16  60.31,31.89 270 bottom
C17  64.78,91.6 270 top
C18  70.77,91.6 270 top
C19  39.32,58.99 90 top
C20  10.84,14.93 90 top
C21  13.82,14.93 90 top
C22  59.26,14.17 270 top
C23  62.51,12.33 90 bottom
C24  73.11,40.53 180 bottom
C25  73.11,43.01 0 bottom
C26  82.01,38.09 270 bottom
C27  78.36,38.09 270 bottom
C28  75.8,38.12 270 bottom
C29  12.58,81.91 270 bottom
D2  45.65,81.31 270 top
FRONT-LEFT  5.23,5.44 315 top
FRONT-RIGHT  5.72,97.36 225 top
IC1  62.59,22.74 0 top
J1  22.45,51.72 270 top
L1  60.09,12.09 180 top
LEDB  48.62,87.2 90 top
LEDG  45.54,87.2 90 top
LEDR  42.46,87.2 90 top
PS1  19.87,86.04 180 top
PWR-INDICATOR  41.34,81.29 270 top
R1  59.43,45.07 90 bottom
R2  29.45,55.99 0 bottom
R3  39.24,87.2 90 top
R4  29.47,50.84 180 bottom
R5  29.45,58.61 0 bottom
R6  29.45,53.38 180 bottom
R7  55.6,52.47 270 bottom
R8  41.46,40.98 270 bottom
R9  44.3,40.98 270 bottom
R10  47.19,40.98 270 bottom
R11  39.91,41.09 270 top
R12  42.4,41.1 270 top
R13  30.6,28.32 0 bottom
R14  29.43,46.49 0 bottom
R15  42,63.92 90 bottom
R16  29.43,48.59 180 bottom
R17  29.43,44.06 180 bottom
R18  65.31,55.2 270 top
R19  62.83,55.2 270 top
U2  78.8,43.12 270 bottom
U3  67.8,86.52 0 top
U4  37.4,67.8 90 top
U5  8.08,85.91 0 bottom
U6  8.08,82.41 0 bottom
U$1  50.8,50.8 90 top
U$2  6.4,51.98 0 top
U$3  38.35,22.79 0 top
U$4  59.26,7.65 180 top
U$5  12.8,20.12 0 top
U$6  53.8,73.59 90 top
U$7  53.8,62.64 90 top
U$8  82.59,88.89 90 top
U$9  80.8,53.12 0 top
U$10  80.8,48.12 0 top
U$11  71.8,21.12 0 top
U$12  71.8,24.12 0 top
U$13  6.4,61.12 0 top
U$14  6.4,58.07 0 top
U$15  6.4,67.12 0 top
U$16  6.4,64.12 0 top
U$17  6.4,73.12 0 top
U$18  6.4,70.12 0 top
U$19  6.4,49.01 0 top
U$20  6.4,55.03 0 top
U$21  6.4,76.12 0 top
U$23  9.4,76.12 0 top
U$24  91.8,73.12 180 top
U$25  91.8,79.12 180 top
U$26  91.8,76.12 180 top
U$27  91.8,82.12 180 top
U$28  31.8,86.12 270 top
U$29  29.8,96.12 90 top

### Tracks (layer width: path | path; a pad name or v marks a point on that pad's centre or on a via)
1.3V  (via drill 0.35)
  Top 0.152: C9.2 28.44,52.97 J1.10 22.41,52.93 19.55,52.93 18.08,54.41 18.08,65.26 v11.82,71.52
  Bottom 0.152: v11.82,71.52 8,71.52 U$17.0 3.8,75.72 3.8,80.49 6.37,83.06 U6.5 6.55,83.06 6.49,82.99 C8.1
2.8V  (via drill 0.35)
  Top 0.152: C10.1 28.94,55.97 J1.4 21.83,55.97 21.47,56.32 21.47,62.4 12.73,71.14 v12.73,71.53
  Bottom 0.152: U$18.0 11.32,70.12 v12.73,71.53 15.23,74.03 15.23,85.25 12.54,87.94 7.88,87.94 U5.5 5.51,86.85 C7.1
3.3V  (via drill 0.35)
  Top 0.152: U$5.8 11.82,16.8 C20.2 | C21.2 13.13,16.51 U$5.6 | C4.1 27.61,52.47 J1.11 | v53.25,53.17 52.53,53.17 U$1.13 | U$1.8 53.71,50.2 54.1,49.81 v54.1,49.78 | U4.9 39.32,63.17 C19.2 | IC1.8 IC1.7 | IC1.6 IC1.7 | v60.3,29.3 60.3,27.43 IC1.7 | C5.1 29.01,51.06 C4.1 | U3.7 63.57,84.89 v63.3,84.62 | R12.1 44.82,44.45 46.08,44.45 | v52.54,44.11 52.2,44.45 46.08,44.45 | v60.8,80.12 57.19,80.12 55.99,78.92 55.99,71.69 55.34,71.05 U$6.1 | C4.1 27.84,51.07 v27.3,51.62 | U$1.22 48.41,50.6 v48.1,50.91 | v45.88,44.22 45.88,44.25 46.08,44.45
  Bottom 0.152: PS1.3 17.37,86 C15.2 | v54.1,49.78 C3.2 | C16.2 v60.31,29.31 v60.3,29.3 | R13.1 31.67,28.32 v32.67,27.31 | R7.2 56.49,51.55 v57.08,50.96 | R15.2 41.8,65.03 v41.8,66.12 | U$6.1 54.43,69.55 55.41,68.58 58.64,68.58 A1.2 60.34,68.08 v61.3,67.12 | v53.69,56.91 52.83,56.04 C2.2 51.8,53.62 52.24,53.17 v53.25,53.17 53.97,53.17 R7.2 | R5.1 30.37,56.12 30.39,56.12 | 30.39,56.12 30.39,56.01 R2.1 | v67.9,87.62 67.8,87.62 | v67.82,82.89 v67.82,82.88 | v66.82,83.9 65.52,83.9 64.8,84.62 v63.3,84.62 60.8,82.12 v60.8,80.12 | v54.1,49.78 54.1,50.05 R7.2 | v54.1,49.78 54.1,46.19 52.54,44.63 v52.54,44.11 | 30.39,56.12 32.8,56.12 33.3,55.62 33.3,54.62 32.06,53.38 R6.2 30.37,53.2 29.46,52.29 27.98,52.29 v27.3,51.62 | 56.47,58.31 v56.5,58.34 | 32.12,77.04 v32.15,77.02 | 27,68.67 v27.02,68.66 | U2.14 77.51,42.62 v76.36,41.46 | C24.2 74.99,40.53 75.33,40.88 v75.33,41.48 75.33,43.02 76.54,44.23 77.8,44.23 U2.1 | v76.36,41.46 76.36,39.55 C28.1 | C27.1 76.36,40.97 v76.36,41.46 | U6.1 10.23,83.06 v10.58,83.41 | U5.3 10.58,83.76 v10.58,83.41 | U6.3 10.1,81.76 v10.45,81.41 | v10.58,83.41 11.95,83.41 C29.1 | U5.1 11.01,86.85 C6.1 v11.58,87.41 | v48.1,50.91 48.1,47.93 45.88,45.71 v45.88,44.22
  Bottom 1.016: v66.82,83.9 v67.82,82.89
  Bottom 1.27: 67.8,87.62 v66.8,88.62 | v54.1,58.31 56.47,58.31 | v35.19,66.08 v35.19,66.09 33.69,67.59 v33.65,67.59
  Bottom 2.54: v80.8,96.62 v80.8,93.86 | v85.8,65.62 v83.8,65.62 | v32.12,78.28 32.12,77.04 | v27,69.76 27,68.67 | v37.8,5.23 v35.74,5.23 v35.73,5.24
  pour Top: -5.85,105.54 -5.85,0.58 -1.7,-3.58 55.07,-3.58 55.07,19.92 56.67,21.52 63.83,21.52 63.83,-0.73 67.06,-3.96 108.59,-3.96 108.59,105.54
  cutout Top: 49.58,51.91 49.58,49.68 49.71,49.55 51.94,49.55 52.08,49.69 52.08,51.9 51.97,52 49.67,52
5V  (via drill 0.35)
  Top 0.152: U3.16 70.77,88.85 71.89,88.85 v71.95,88.79 | C18.2 72.94,90.73 78.28,96.06 96.59,96.06 BACK-RIGHT.2 96.72,96.17 96.72,76.48 v96.68,76.44 | C18.2 69.19,90.73 67.8,92.12 67.8,95.62 66.3,97.12 43,97.12 34.65,88.77 v34.65,87.77 U$28.1 32.64,88.42 v32.64,90.66 | FRONT-RIGHT.2 5.8,97.27 5.8,94.12 3.3,91.62 3.3,66.62 5.8,64.12 U$16.0 4.41,62.12 4.41,9.26 5.23,8.44 FRONT-LEFT.2 | C18.2 68.77,90.73 v68.5,90.45
  Bottom 0.152: v34.65,87.77 34.65,85.84 C14.2 | v96.68,76.44 97.79,75.33 97.79,9.05 95.79,7.05 95.79,4.68 BACK-LEFT.2 | v32.64,90.66 32.43,90.44 15.13,90.44 11.22,94.36 8.72,94.36 FRONT-RIGHT.2 | v71.95,88.79 70.29,90.45 v68.5,90.45
ANT
  Top 0.152: 59.26,12.25 L1.2 59.25,11.92 | U$4.2
  Top 0.508: C22.2 59.26,12.25 | 59.25,11.92 U$4.2
BUZZER  (via drill 0.35)
  Top 0.152: U4.24 v34.22,70.11 | v61.3,44.12 61.3,38.62 67.11,32.8 BUZZER.1
  Bottom 0.152: BUZZER.1 71.14,34.3 71.14,41.82 57.45,55.52 57.45,65.97 56.09,67.32 37.01,67.32 v34.22,70.11 | R1.1 59.47,44.12 v61.3,44.12
CAM_I2C_SCL  (via drill 0.35)
  Top 0.152: v25.36,55.38 | v25.36,55.38 25.26,55.47 J1.5 | v34.2,65.44 34.2,65.89 37.55,69.24 45.46,69.24 47.16,70.94 47.16,76.97 54.49,84.31 61.99,84.31 64.18,82.12 v64.8,82.12 | v74.2,77.6 73.92,77.32 73.92,72.66 v73.9,72.64 | v27.54,56.51 28.36,57.33 31.01,57.33 33.3,59.62 v33.3,61.12
  Bottom 0.152: v25.36,55.38 25.96,55.99 R2.2 28.06,55.99 v27.54,56.51 | v34.2,65.44 34.2,62.15 33.3,61.26 v33.3,61.12 | v64.8,82.12 64.8,81.62 68.82,77.6 v74.2,77.6 | v73.9,72.64 73.9,70.01 75.84,68.08 A1.37
CAM_I2C_SDA  (via drill 0.35)
  Top 0.152: v47.36,70.23 47.85,70.73 47.85,77.05 54.4,83.59 62.28,83.59 63.53,82.34 v63.53,81.76 | J1.3 25.77,56.47 v25.82,56.52
  Bottom 0.152: v47.36,70.23 45.82,71.77 34.02,71.77 27.79,65.54 27.79,59.34 R5.2 26.45,56.53 26.44,56.52 v25.82,56.52 | v63.53,81.76 64.16,81.76 68.95,76.97 A1.30
CAM_PWDN  (via drill 0.35)
  Top 0.152: J1.8 25.86,53.97 v26.33,54.44 | U4.6 35.49,62.19 34.75,61.45 34.75,56.31 32.3,53.86 v32.3,52.12
  Bottom 0.152: v26.33,54.44 26.29,54.4 26.29,51.57 27.02,50.84 R4.1 29.61,51.9 32.08,51.9 v32.3,52.12
CAM_RESET  (via drill 0.35)
  Top 0.152: v32.3,54.62 34.22,56.54 U4.5 | J1.6 23.8,54.97 24.27,54.5 25.47,54.5 v26.31,55.34
  Bottom 0.152: v26.31,55.34 28.27,53.38 R6.1 29.77,54.62 v32.3,54.62
DVP_HREF  (via drill 0.35)
  Top 0.152: v53.51,79.75 51.37,77.62 v50.3,77.62 | J1.9 20.14,53.47 v19.9,53.71
  Bottom 0.152: A1.12 58.94,80.78 58,79.83 53.59,79.83 v53.51,79.75 | v50.3,77.62 50.3,77.37 49.77,76.84 49.77,75.08 46.8,72.12 33.8,72.12 22.58,60.9 22.42,60.74 19.9,58.22 v19.9,53.71
DVP_PCLK  (via drill 0.35)
  Top 0.152: J1.17 25.09,49.47 28.84,45.72 33.06,45.72 33.06,45.73 35.13,47.8 35.13,48.55 v38.67,52.09 | v48.1,62.64 48.1,62.72 56.31,70.92 56.31,78.44 v56.55,78.69
  Bottom 0.152: v48.1,62.64 44.37,58.91 44.37,57.79 v38.68,52.09 v38.67,52.09 | A1.10 57.01,78.24 v56.55,78.69
DVP_VSYNC  (via drill 0.35)
  Top 0.152: v61.8,86.62 v55.8,86.62 54.73,86.62 42.24,74.13 39.31,74.13 v39.3,74.12 | J1.7 22.43,54.49 v19.14,54.49
  Bottom 0.152: v39.3,74.12 35.3,74.12 19.14,57.95 v19.14,54.49 | v61.8,86.62 65.8,86.62 74.18,78.24 A1.29
DVP_Y2  (via drill 0.35)
  Top 0.152: J1.19 24.94,48.47 28.3,45.12 34.55,45.12 38.74,49.31 v38.74,50.44 | v48.03,60.2 50.03,62.2 50.03,62.54 56.62,69.13 56.62,73.76 57.71,74.85 59.73,74.85 v60.58,74
  Bottom 0.152: v48.03,60.2 45.28,57.44 45.28,56.97 v38.74,50.44 | A1.6 59.74,73.16 v60.58,74
DVP_Y3  (via drill 0.35)
  Top 0.152: J1.21 24.78,47.47 v24.96,47.65
  Bottom 0.152: R14.2 28.06,46.49 26.89,47.65 v24.96,47.65
DVP_Y4  (via drill 0.35)
  Top 0.152: v25.36,46.93 25.32,46.97 J1.22
  Bottom 0.152: v25.36,46.93 28.23,44.06 R17.1
DVP_Y5  (via drill 0.35)
  Top 0.152: J1.20 22.48,47.94 21.62,47.94 21.08,47.4 21.08,45.41 22.87,43.62 33.48,43.62 43.3,53.43 v43.3,53.62 | v48.12,58.89 51.12,61.89 51.12,63.03 56.93,68.84 56.93,73.25 v57.8,74.12
  Bottom 0.152: v48.12,58.89 43.3,54.07 v43.3,53.62 | A1.7 58.11,74.43 v57.8,74.12
DVP_Y6  (via drill 0.35)
  Top 0.152: J1.18 24.94,48.97 28.49,45.42 33.19,45.42 33.19,45.43 35.43,47.67 35.43,48.08 v40.22,52.87 | v47.96,61.36 48.39,61.36 56.06,69.03 v56.06,69.37
  Bottom 0.152: v56.06,69.37 58.58,71.89 A1.5 | v47.96,61.36 44.8,58.2 44.8,57.45 v40.22,52.87
DVP_Y7  (via drill 0.35)
  Top 0.152: v25.39,49.93 22.49,49.93 J1.16
  Bottom 0.152: R16.1 27.18,49.93 v25.39,49.93
DVP_Y8  (via drill 0.35)
  Top 0.152: J1.14 25.1,50.97 25.92,50.15 25.92,49.07 28.97,46.03 32.93,46.03 34.82,47.92 34.82,49.01 v36.45,50.64 | v44.4,67.86 43.8,67.26 v43.8,65.62 | v36.45,50.64
  Bottom 0.152: A1.31 75.88,75.7 66.3,66.11 58.46,66.11 58.45,66.12 57.73,66.12 56.22,67.63 44.63,67.63 v44.4,67.86 | v43.8,65.62 43.8,57.99 v36.45,50.64
DVP_Y9  (via drill 0.35)
  Top 0.152: J1.12 24.96,51.97 26.53,50.4 26.53,49.42 29.31,46.64 32.67,46.64 34.21,48.18 34.21,49.91 42.45,58.15 42.45,64.14 42.93,64.62 45.8,64.62 48.16,66.97 48.16,76.92 54.36,83.13 61.79,83.13 v62.3,82.62 | v62.24,73.17 62.24,80.06 v62.3,80.12
  Bottom 0.152: A1.4 59.69,70.62 v62.24,73.17 | v62.3,80.12 v62.3,82.62
ESC_BL
  Top 0.152: U3.10 69.07,84.89 66.87,82.69 64.04,82.69 62.11,84.62 54.3,84.62 46.85,77.17 46.85,71.06 45.35,69.56 37.42,69.56 33.6,65.73 33.6,62.32 32.89,61.62 32.3,61.62 31.68,62.23 U4.3
ESC_BL_OUT
  Top 0.152: U3.11 70.79,85.62 71.8,85.62 74.05,87.87 74.05,89.85 78.95,94.74 83.76,94.74 89.13,89.37 89.13,80.78 90.8,79.12 U$25.0
  Bottom 0.152: U$25.0 95.3,79.12 98.23,76.18 98.23,6.83 BACK-LEFT.3
ESC_BR
  Top 0.152: U4.4 32.95,65.52 37.32,69.88 45.23,69.88 46.54,71.2 46.54,77.36 54.3,85.12 62.05,85.12 64.17,82.99 66.72,82.99 69.3,85.57 69.3,86.66 70.12,87.48 U3.14
ESC_BR_OUT
  Top 0.152: U3.13 72.55,86.85 73.7,87.99 73.7,90.01 78.8,95.11 84.26,95.11 90.03,89.35 90.03,83.88 U$27.0
  Bottom 0.152: BACK-RIGHT.3 91.8,94.87 U$27.0
ESC_FL
  Top 0.152: U4.2 30.41,63.41 37.2,70.2 45.1,70.2 46.23,71.33 46.23,77.55 54.23,85.55 U3.6
ESC_FL_OUT
  Top 0.152: U3.5 65.69,86.19 69.12,89.61 72.8,89.61 78.63,95.45 84.82,95.45 95.3,84.96 95.3,79.62 U$26.0
  Bottom 0.152: U$26.0 91.87,76.12 97.38,70.61 97.38,9.33 91.76,3.72 91.68,3.64 FRONT-LEFT.3 | FRONT-LEFT.3
ESC_FR  (via drill 0.35)
  Top 0.152: U3.3 63.93,87.48 54.8,96.62 43.3,96.62 35.8,89.12 35.8,79.62 33.8,77.62 25.64,77.62 24.05,76.02 v24.05,71.03 | v23,69.97 23,66.92 26.72,63.19 U4.1
  Bottom 0.152: v24.05,71.03 v23,69.97
ESC_FR_OUT  (via drill 0.35)
  Top 0.152: v56.8,93.58 57.3,93.58 64.04,86.85 U3.4 65.91,86.84 68.98,89.92 72.6,89.92 78.44,95.76 85.39,95.76 95.8,85.35 95.8,79.37 95.09,78.66 95.09,74.41 93.8,73.12 U$24.0
  Bottom 0.152: v56.8,93.58 56.77,93.62 36.8,93.62 33.3,90.12 14.3,90.12 10.8,93.62 8.3,93.62 6.36,95.56 FRONT-RIGHT.3
GND  (via drill 0.35)
  Top 0.152: C5.2 30.76,51.06 | 30.76,51.06 C4.2 C9.1 C10.2 | J1.2 24.28,56.97 v24.62,57.3 | J1.Z2 19.7,42.59 v19.68,42.57 | C17.1 v62.83,92.47 v62.82,92.47 | C18.1 70.71,92.42 v68.89,92.42 | IC1.1 66.99,25.89 v67.01,25.87 | IC1.12 v60.39,16.79 v60.4,16.78 | IC1.10 v58.19,16.82 v58.19,16.81 | U$3.13 50.41,12.01 v50.39,12.03 | U$4.3 57.71,9.25 v56.89,10.06 | v55.33,50.36 55.09,50.6 U$1.9 51,50.6 U$1.P$1 51.41,50.8 52,51.39 52.44,51.39 U$1.11 | U$1.20 48.63,51.4 v48.14,51.89 | U4.10 40.57,61.21 v40.98,60.81 | v40.91,58.09 39.34,58.09 C19.1 | U$3.6 32.1,31.14 v32.12,31.11 | U$3.3 38.8,31.17 v38.83,31.14 | R3.2 LEDR.2 LEDG.2 LEDB.2 v50.8,88.11 v50.8,88.12 | U$3.12 24.41,10.84 v26.08,10.84 | C21.1 C20.1 9.15,14.06 v9.11,14.09 | U$5.1 11.8,20.86 v11.8,22.62 | U$5.7 v12.47,17.63 | U$28.2 v31.8,83.12 | U3.8 v64.87,83.56 | 39.32,66.1 v39.3,66.08 | 67.21,85.94 v67.21,85.97 | U$1.18 49.8,53.99 | v34.8,52.12 33.75,51.06 30.76,51.06 | 72.83,80.66 v72.95,80.66 | 44.38,73.68 v44.38,74.04 | 23.8,89.42 v23.78,89.41 | 82.03,44.88 v82.03,44.85 | v78.22,57.1 78.24,57.12 | 18.37,76.85 v18.42,76.91 | 54.96,48.33 v54.97,48.32 | v57.13,76.88 57.18,76.83 | v62.93,47.09 | v21.35,66.05 v21.35,66.04 | U$4.1 60.81,8.96 v61.85,10 | J1.Z1 19.58,59.39 v19.58,60.91 | J1.15 20.73,50.47 v20.25,49.99 | v76,42.94 74.58,44.36 v74.58,44.91 | v60.15,50.95
  Top 0.508: U4.17 44.38,73.68 U4.15
  Top 0.61: U4.15 U4.16 U4.17
  Top 0.813: v66.45,85.18 67.21,85.94
  Top 1.016: v48.56,53.47 49.08,53.99 49.8,53.99 v52.45,53.99 | v56.8,60.08 56.84,60.08 58.27,58.65 v58.35,58.65
  Top 1.27: v39.32,68.01 39.32,66.1 | v57.8,72.62 60.8,72.62 v62.3,71.12 | U4.16 v44.38,74.04 | v81.23,45.68 82.03,44.88 | v53.56,48.33 54.96,48.33 | v61.35,76.83 57.18,76.83
  Top 2.54: v26.39,91.15 v26.39,89.39 | v49.3,27.62 v49.3,29.62 | v51.8,27.62 v51.8,29.62 | v54.3,27.62 v54.3,29.62 | v66.3,67.62 v81.3,67.62 | v13.8,93.12 v11.8,91.12 | v65.32,79.21 65.34,79.23 v68.52,79.23 | v71.71,79.54 | 72.83,80.66 v71.71,79.54 | v70.3,30.12 v71.8,28.62 | v23.8,91.12 23.8,89.42 | v86.2,78.33 84.7,76.83 v84.7,76.81 | 78.24,57.12 v79.83,57.12 | v16.18,76.85 18.37,76.85 | v61.53,52.33 v60.15,50.95 | v61.18,47.09 v62.93,47.09 | v20.27,67.13 v21.35,66.05 | v82.07,4.84 v82.07,2.98 | v23.44,64.17 v23.44,64.16 v25.2,62.4
  Bottom 0.152: C11.1 80.05,84.7 U$8.A | U$6.9 U$6.7 U$6.5 U$6.3 | R4.2 33.52,50.84 v34.8,52.12 | U2.16 76.48,43.62 76,43.13 v76,42.94 | v76,42.94
  other vias: 56.09,19.03 56.36,19.85 57.15,20.63 57.15,19.85 58.96,20.57 58.14,20.6 58.14,19.81 58.96,19.78 59.8,19.77 59.8,20.55 60.63,20.54 60.63,19.75 61.47,20.51 61.47,19.72 56.08,15.64 56.05,14.81 56.1,16.48 56.11,17.31 56.14,18.14 58.01,12.49 58.04,13.31 58.05,14.15 58.06,14.98 58.1,15.82 55.95,10.44 55.98,11.26 55.99,12.1 56.01,12.93 56.04,13.77 57.96,10.61 57.99,11.45 58.66,5.09 59.49,5.06 59.49,5.85 58.66,5.88 57.82,5.89 57.82,5.1 56.99,5.12 56.99,5.9 56.16,5.15 56.16,5.94 62.02,6.58 61.99,5.75 62.78,5.75 62.81,6.58 62.82,7.42 62.04,7.42 62.05,8.25 62.84,8.25 62.08,9.08 62.87,9.08 55.82,8.84 56.61,8.84 56.6,8.01 55.81,8.01 56.56,7.17 55.78,7.17 60.37,5.85 61.16,5.85 61.15,5.02 60.36,5.02 60.62,10.62 62.85,10 60.09,13.01 60.86,13.35 60.25,14.98 60.28,15.81 60.97,14.15 61.37,14.91 61.39,15.74 61.42,16.58
  pour Top: 55.55,4.48 55.55,19.57 57.02,21.04 61.85,21.04 61.85,13.4 63.37,11.87 63.37,4.48
  pour Bottom: -3.07,103.9 -3.07,3.31 1.77,-1.53 52.08,-1.53 54.84,1.23 54.84,19.72 56.59,21.47 57.02,21.04 55.55,19.57 55.55,4.4 63.45,4.4 63.5,4.45 63.5,11.74 61.9,13.34 61.9,20.91 61.8,21.02 61.04,21.02 61.57,21.55 61.8,21.55 62.1,21.24 62.28,21.24 62.28,13.55 63.83,12 63.83,4.66 64.08,4.4 63.73,4.05 55.02,4.05 55.02,1.58 58.07,-1.47 104.49,-1.47 104.49,103.9
  cutout Bottom: 78.08,43.91 79.58,43.91 79.58,42.41 78.08,42.41
GPIO_A6  (via drill 0.35)
  Top 0.152: U$2.0 8.08,53.66 8.08,70.41 11.75,74.08 v18.17,74.08 | U4.27 30.41,70.69 v30.43,70.67
  Bottom 0.152: v18.17,74.08 20.49,76.41 29.08,76.41 30.43,75.05 v30.43,70.67
GPIO_A7  (via drill 0.35)
  Top 0.152: U$19.0 8.66,51.27 8.66,70.18 11.64,73.16 v16.68,73.16 | U4.28 28.4,73.16 v25.81,73.16
  Bottom 0.152: v16.68,73.16 v25.8,73.16 v25.81,73.16
GPIO_B6  (via drill 0.35)
  Top 0.152: v32.41,59.75 24.68,59.75 14.15,70.28 v14.15,70.48 | U4.7 36.76,61.51 v36.75,61.5
  Bottom 0.152: U$14.0 7.8,59.47 7.8,62.85 8.32,63.37 8.32,64.65 v14.15,70.48 | v36.75,61.5 35,59.75 v32.41,59.75
GPIO_B7  (via drill 0.35)
  Top 0.152: v15.97,69.26 24.92,60.31 28.37,60.31 v28.38,60.3 | v35.33,60.98 35.83,60.49 37.27,60.49 38.08,61.3 38.08,63.15 U4.8
  Bottom 0.152: U$20.0 8.4,57.03 8.4,62.74 8.89,63.24 8.89,64 14.16,69.26 v15.97,69.26 | v28.38,60.3 34.65,60.3 v35.33,60.98
GPS_RX  (via drill 0.35)
  Top 0.152: U$11.0 69.8,21.12 64.79,26.13 IC1.3 64.79,27.81 64.8,27.8 v64.8,29.15 | v63.54,68.58 60.07,68.58 55.6,64.12 55.6,56.41 v56.3,55.71
  Bottom 0.152: A1.8 60.72,75.7 63.99,72.42 63.99,69.04 v63.54,68.58 | v56.3,55.71 61.87,50.14 61.87,40.17 64.8,37.24 v64.8,29.15
GPS_TX  (via drill 0.35)
  Top 0.152: U$12.0 67.8,24.12 65.89,26.03 IC1.2 v65.89,29.15 | v64.3,68.58 v64.29,68.58 63.76,68.05 59.97,68.05 55.91,63.99 55.91,57.12 56.29,56.73 v56.32,56.73 | v65.89,29.15
  Bottom 0.152: A1.9 59.95,76.97 64.3,72.62 v64.3,68.58 | v65.89,29.15 65.3,29.74 65.3,37.62 62.3,40.62 62.3,50.19 57.03,55.45 57.03,56.02 v56.32,56.73
I2C_SCL  (via drill 0.35)
  Top 0.152: U4.12 43.11,55.67 45.16,53.63 v45.16,52.65 47.6,50.2 U$1.23 | U$5.4 13.77,28.34 19.05,33.62 20.8,33.62 v21.8,34.62 | v48.13,55.42 48.68,54.87 62.07,54.87 62.83,54.12 | U$10.0 78.74,46.05 70.89,46.05 62.83,54.12 | R19.2 62.83,54.12
  Bottom 0.152: A1.36 78.07,69.35 78.8,68.62 78.8,50.12 U$10.0 79.3,46.62 U2.4 | v21.8,34.62 27.3,34.62 45.16,52.47 v45.16,52.65 45.16,53.44 47.13,55.42 v48.13,55.42
I2C_SDA  (via drill 0.35)
  Top 0.152: U$5.3 13.12,28.52 20.22,35.62 v21.8,35.62 | U$1.24 46.51,49.8 45.07,51.24 v42.39,51.24 | U4.13 44.38,57.22 v45.85,55.76 | v48.13,56.18 48.24,56.18 49.24,55.18 56.8,55.18 58.8,57.18 68.2,57.18 | U$9.0 78.8,53.12 74.74,57.18 68.2,57.18 | R18.2 68.2,57.18
  Bottom 0.152: v45.85,55.76 45.85,54.7 v42.39,51.24 | v21.8,35.62 27.66,35.62 42.39,50.34 v42.39,51.24 | v42.39,51.24 47.33,56.18 v48.13,56.18 | A1.33 77.26,73.16 79.3,71.12 79.3,54.62 U$9.0 82.49,51.42 82.49,46.17 80.05,43.72 80.03,43.72 U2.6
JTAG_TCK  (via drill 0.35)
  Top 0.152: U$6.4 51.86,72.32 49.8,70.25 49.8,66.22 47.3,63.72 47.3,52.92 v47.57,52.66
  Bottom 0.152: A1.16 59.06,85.78 56.03,85.78 51.49,81.24 51.49,74.15 53.16,72.48 U$6.4 | R9.1 44.3,44.62 47.57,47.89 v47.57,52.66
JTAG_TDI  (via drill 0.35)
  Top 0.152: v49.27,66.44 49.24,66.47 49.24,77.55 54.28,82.59 v55.94,82.59
  Bottom 0.152: U$6.8 51.8,76.22 51.8,81.12 54,83.32 A1.14 56.66,83.32 v55.94,82.59 | R10.1 49.27,43.98 v49.27,66.44
JTAG_TDO  (via drill 0.35)
  Top 0.152: v74.66,85.86 74.66,84.97 70.8,81.12 56.8,81.12 51.97,76.29 51.97,73.78 52.16,73.59 U$6.6 52.2,72.62 51.74,72.62 50.13,71.01 v49.8,71.01 | v48.7,69.21 48.7,67.04 46.57,64.92 v46.57,53.99 v46.58,53.99 | R11.1 39.91,43 v39.92,43.01
  Bottom 0.152: v74.66,85.86 | v74.66,85.86 A1.23 | v49.8,71.01 48.7,69.9 v48.7,69.21 | v39.92,43.01 39.92,46.53 46.58,53.19 v46.58,53.99
JTAG_TMS  (via drill 0.35)
  Top 0.152: v55.17,82 54.64,82 v50.95,78.31 | v48.67,64.21 53.16,68.71 U$6.2
  Bottom 0.152: U$6.2 50.95,73.26 v50.95,78.31 | v55.17,82 55.22,82.05 A1.13 | R8.1 41.46,47.3 48.67,54.51 v48.67,64.21
LED_B
  Top 0.152: U4.21 38.03,73.69 39.05,74.71 42.39,74.71 46.8,79.12 46.8,79.61 D2.6
LED_G
  Top 0.152: U4.22 36.76,73.08 38.74,75.05 42.24,75.05 45.65,78.47 D2.5
LED_R
  Top 0.152: U4.23 35.49,72.81 38.11,75.43 42.11,75.43 44.65,77.97 D2.4
N$1
  Top 0.152: LEDR.1 44.65,84.09 D2.3
N$2
  Top 0.152: LEDG.1 45.65,86.17 D2.2
N$3  (via drill 0.35)
  Top 0.152: U$1.10 55.91,51 v56.8,50.12
  Bottom 0.152: v56.8,50.12 55.84,50.12 55.55,49.82 54.93,49.82 54.43,49.33 54.43,47.57 56.07,45.93 C1.2
N$4
  Top 0.152: LEDB.1 46.65,84.31 D2.1
N$5
  Bottom 0.152: C26.1 81.92,39.06 81.92,41.15 80.45,42.62 U2.8
N$6
  Top 0.152: R3.1 41.34,84.18 PWR-INDICATOR.1
N$18
  Bottom 0.152: U2.2 78.3,45.61 78.07,45.84 76.91,45.84 74.07,43.01 C25.1
N$21
  Top 0.152: 59.29,14.63 C22.1
  Top 0.508: IC1.11 59.29,14.63
N$23  (via drill 0.35)
  Top 0.152: U4.18 41.84,71.76 v40.82,70.74
  Bottom 0.152: v40.82,70.74 v40.81,70.73 33.91,70.73 33.6,70.41 33.6,69.22 36.21,66.62 40.28,66.62 41.01,65.88 41.01,63.98 R15.1
PROGRAM_EN  (via drill 0.35)
  Top 0.152: U$7.1 54.55,61.37 54.76,61.15 v54.76,56.88 | v57.5,69.32 57.5,68.32 55.75,66.56 v55.75,66.54 | U$8.B@1 81.58,94.39 79.07,94.39 75.4,90.71 75.4,80.21 72.8,77.62 64.8,77.62 62.89,75.71 v62.89,72.72 | v34.38,69.2 24.75,69.2 19.33,74.62 10.9,74.62 U$23.0
  Bottom 0.152: C11.2 84.55,84.38 U$8.B U$8.B@1 | R7.1 55.6,56.05 v54.76,56.88 | U$7.1 56.68,63.62 56.68,65.6 v55.75,66.54 55.28,67.01 36.57,67.01 v34.38,69.2 | v57.5,69.32 57.52,69.35 A1.3 59.51,69.35 v62.89,72.72
PROGRAM_IO0  (via drill 0.35)
  Top 0.152: v51.88,46.12 51.65,45.89 51.65,45.88 50.84,45.06 39.35,45.06 37.56,46.85 v37.56,46.88 | v78.51,83.34 78.51,82.84 65.79,70.12 60.21,70.12 55.21,65.12 54.37,65.12 U$7.6
  Bottom 0.152: U$7.6 51.59,63.91 50.3,62.62 50.3,54.95 51.2,54.05 51.2,52.63 50.27,51.69 50.27,50.58 50.28,50.57 50.28,47.97 51.88,46.37 v51.88,46.12 | R14.1 31.85,44.99 35.73,44.99 37.56,46.82 v37.56,46.88 | A1.25 78.49,83.32 v78.51,83.34
PROGRAM_RX  (via drill 0.35)
  Top 0.152: U$7.5 60.14,69.62 69.72,69.62 72.01,71.9 v75.01,71.9 | v51.12,46.1 50.39,45.37 44.18,45.37 40.39,49.16 v40.37,49.16
  Bottom 0.152: A1.34 75.03,71.89 v75.01,71.9 | U$7.5 54.43,64.48 53.8,65.12 52.29,65.12 49.93,62.75 49.93,54.89 50.9,53.93 50.9,52.75 49.92,51.78 49.92,47.29 v51.12,46.1 | v40.37,49.16 40.37,48.92 35.51,44.06 R17.2
PROGRAM_TX  (via drill 0.35)
  Top 0.152: v75.02,70.64 73.5,69.12 60.07,69.12 55.3,64.34 55.3,63.5 U$7.3 | v40.95,49.71 40.95,49.46 44.74,45.68 49.86,45.68 v50.3,46.12
  Bottom 0.152: A1.35 75.05,70.62 v75.02,70.64 | R16.2 37.35,48.59 38.47,49.71 v40.95,49.71 | v50.3,46.12 49.62,46.8 49.62,51.93 50.56,52.87 50.56,53.82 49.61,54.77 49.61,62.93 52.3,65.62 54.8,65.62 55.43,64.98 55.43,63.64 U$7.3
SD_CD  (via drill 0.35)
  Top 0.152: U$3.10 40.45,30.76 39.3,29.62 24.3,29.62 22.8,31.12 22.8,36.12 16.49,42.42 16.49,62.88 v16.51,62.9 | U4.26 31.68,72.73 30.8,73.62 | 30.8,73.62 | 30.8,73.62 30.44,73.98 v28.87,73.98
  Bottom 0.152: v28.87,73.98 28.48,73.98 17.4,62.9 v16.51,62.9
SD_CLK  (via drill 0.35)
  Top 0.152: U$3.5 34.66,32.81 v34.66,34.73
  Bottom 0.152: v34.66,34.73 36.13,34.73 R8.2
SD_CMD
  Top 0.152: R11.2 42.38,40.17 | 42.38,40.17 R12.2 | U$3.2 42.38,33.03 42.38,40.17
SD_DAT0  (via drill 0.35)
  Top 0.152: U$3.7 29.8,32.61 v29.8,30.62 | v51.8,4.18 37.8,4.18 27.89,14.09 v27.89,28.35
  Bottom 0.152: v29.8,30.62 29.8,28.43 R13.2 27.92,28.32 v27.89,28.35 | v51.8,4.18 51.8,4.12 91.35,4.12 96.8,9.56 96.8,64.12 87.8,73.12 87.8,75.12 78.33,84.59 A1.24
SD_DAT1  (via drill 0.35)
  Top 0.152: U$3.8 27.96,33.28 39.44,44.75 63.66,44.75 69.3,39.12 80.3,39.12 84.55,43.36 84.55,73.02 78.51,79.06 v78.51,82.08
  Bottom 0.152: A1.26 76.79,82.08 v78.51,82.08
SD_DAT2  (via drill 0.35)
  Top 0.152: U$3.9 47.1,35.65 v47.12,35.67
  Bottom 0.152: v47.12,35.67 47.12,39.98 R10.2
SD_DAT3  (via drill 0.35)
  Top 0.152: U$3.1 v44.6,35.72 v44.61,35.73
  Bottom 0.152: v44.61,35.73 44.61,39.73 44.3,40.03 R9.2
SD_WP  (via drill 0.35)
  Top 0.152: U$3.11 24.62,35.29 17.3,42.62 v17.3,64.62 | U4.25 32.95,72.96 31.18,74.74 v28.88,74.74 v28.87,74.74
  Bottom 0.152: v17.3,64.62 18.68,64.62 28.8,74.74 v28.87,74.74
VBAT  (via drill 0.35)
  Top 0.152: 28.83,87.77 U$28.3 30.3,95.62 U$29.V_BAT | 28.83,87.77 v28.81,87.78 | PS1.1 24.14,87.77 28.83,87.77
  Bottom 0.152: PS1.1 22.41,83.38 C13.2 17.39,77.59 17.39,75.36 7.91,65.87 7.91,63.57 6.4,62.07 U$13.0 | v28.81,87.78 28.81,85.97 C12.2
VCC_RF  (via drill 0.35)
  Top 0.152: 62.6,18.12 IC1.14
  Top 0.508: 62.6,18.12 v62.6,14.31 62.6,13.92 L1.1
  Bottom 0.152: 62.6,13.29 C23.2
  Bottom 0.508: v62.6,14.31 62.6,13.29
XMCLK  (via drill 0.35)
  Top 0.152: J1.13 25.03,51.47 26.23,50.27 26.23,49.2 29.09,46.33 32.8,46.33 34.52,48.05 34.52,49.79 34.97,50.24 v35.3,50.24 | v42.7,65.89 42.7,67.02 44.08,68.4 45.89,68.4 46.11,68.17 v47.61,68.17 | v52.67,77.74 51.55,76.62 v50.3,76.62
  Bottom 0.152: v42.7,65.89 43.3,65.29 43.3,58.25 v35.3,50.24 | v52.67,77.74 53.08,77.74 54.84,79.51 A1.11 | v50.3,76.62 50.3,72.27 47.61,69.57 v47.61,68.17 | v35.3,50.24

### Text on the board
tPlace: Front Right | - | + | Back Right | > | > | > | RESET | BR | BL | ENABLE | ESC | GND | FL | 1.3V | FR | 2.8V | 3.3V | 5V | VBAT | B6 | B7 | SDA | A6 | I2C | 2020 POWER UP FIG QUADCOPTER | A7 | SCL | TX | GPS | RX | Front Left | Back Left
bPlace: Class of 2023 / Zoom University | Adeel Rehman / Alec Neiman / Allen Jiang / Andy Ly / Jason Math / Jeffrey Liu / Lauren Head / Masaad Khan / Ryan McSweeney